# EAGLE schematic experimenter (EAGLE 9.6.2), part 1 of 2

## Sheet 1 of 2: NMOS Array
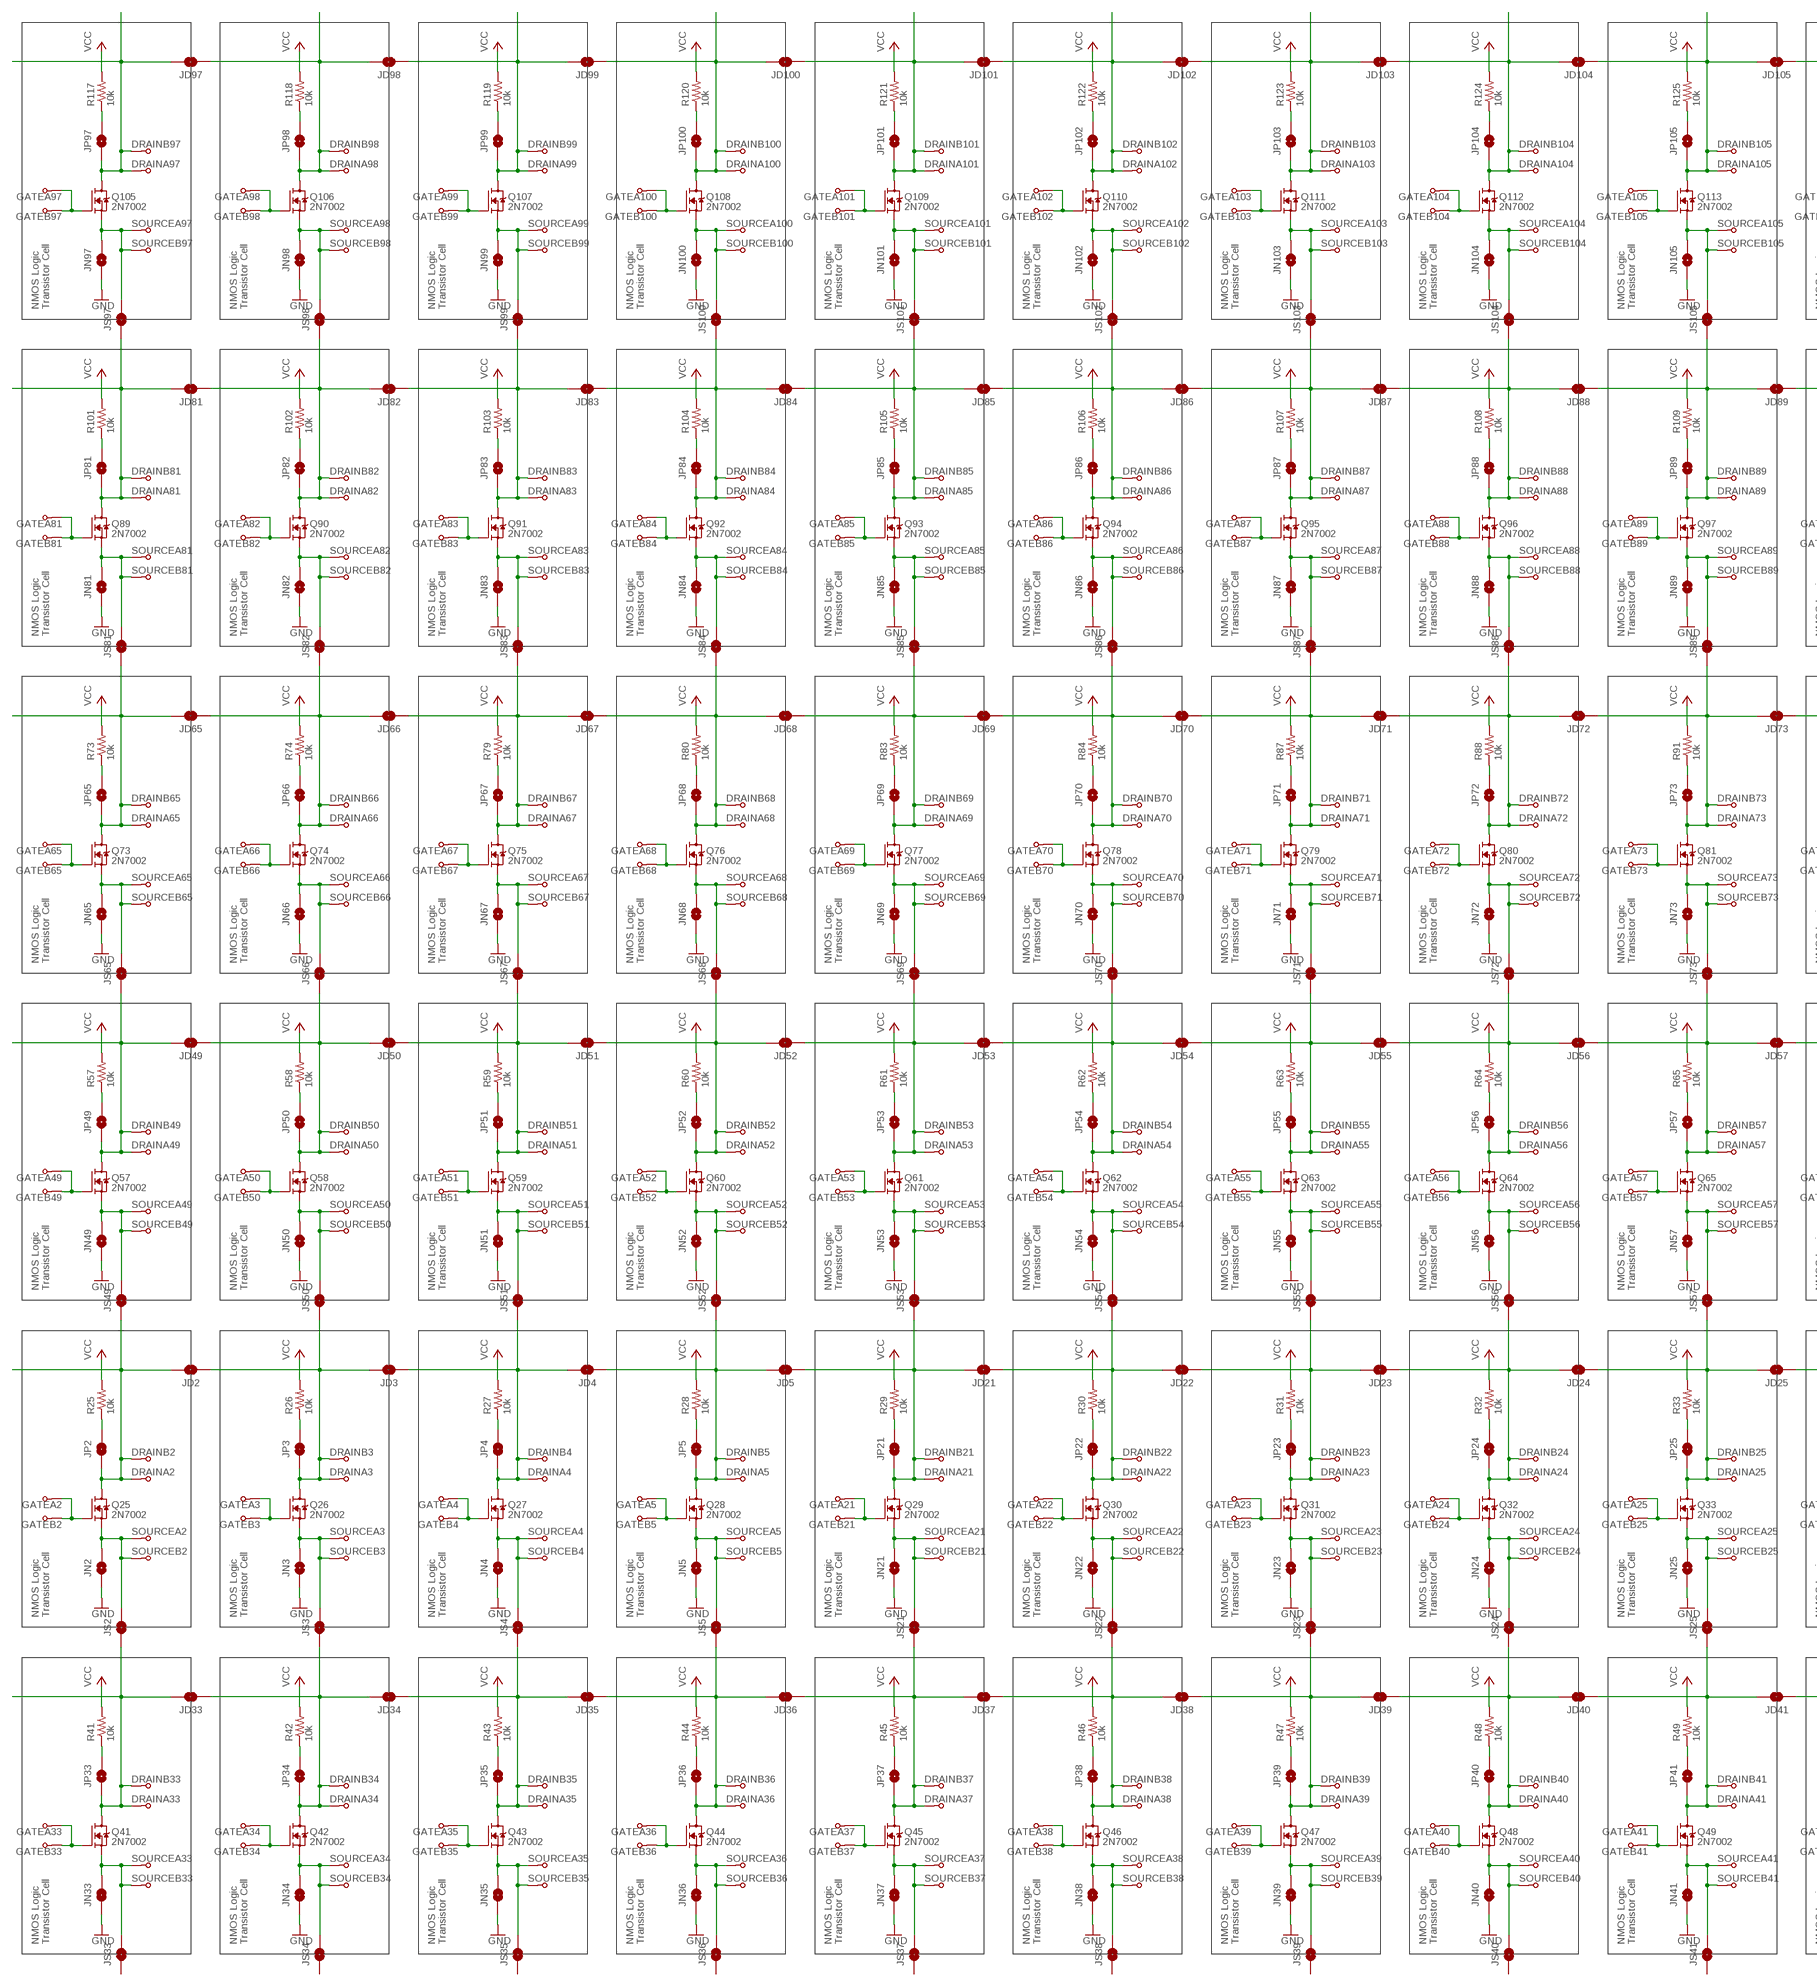
[diagram p0: schematic, sheet 1, part 1 of 2]
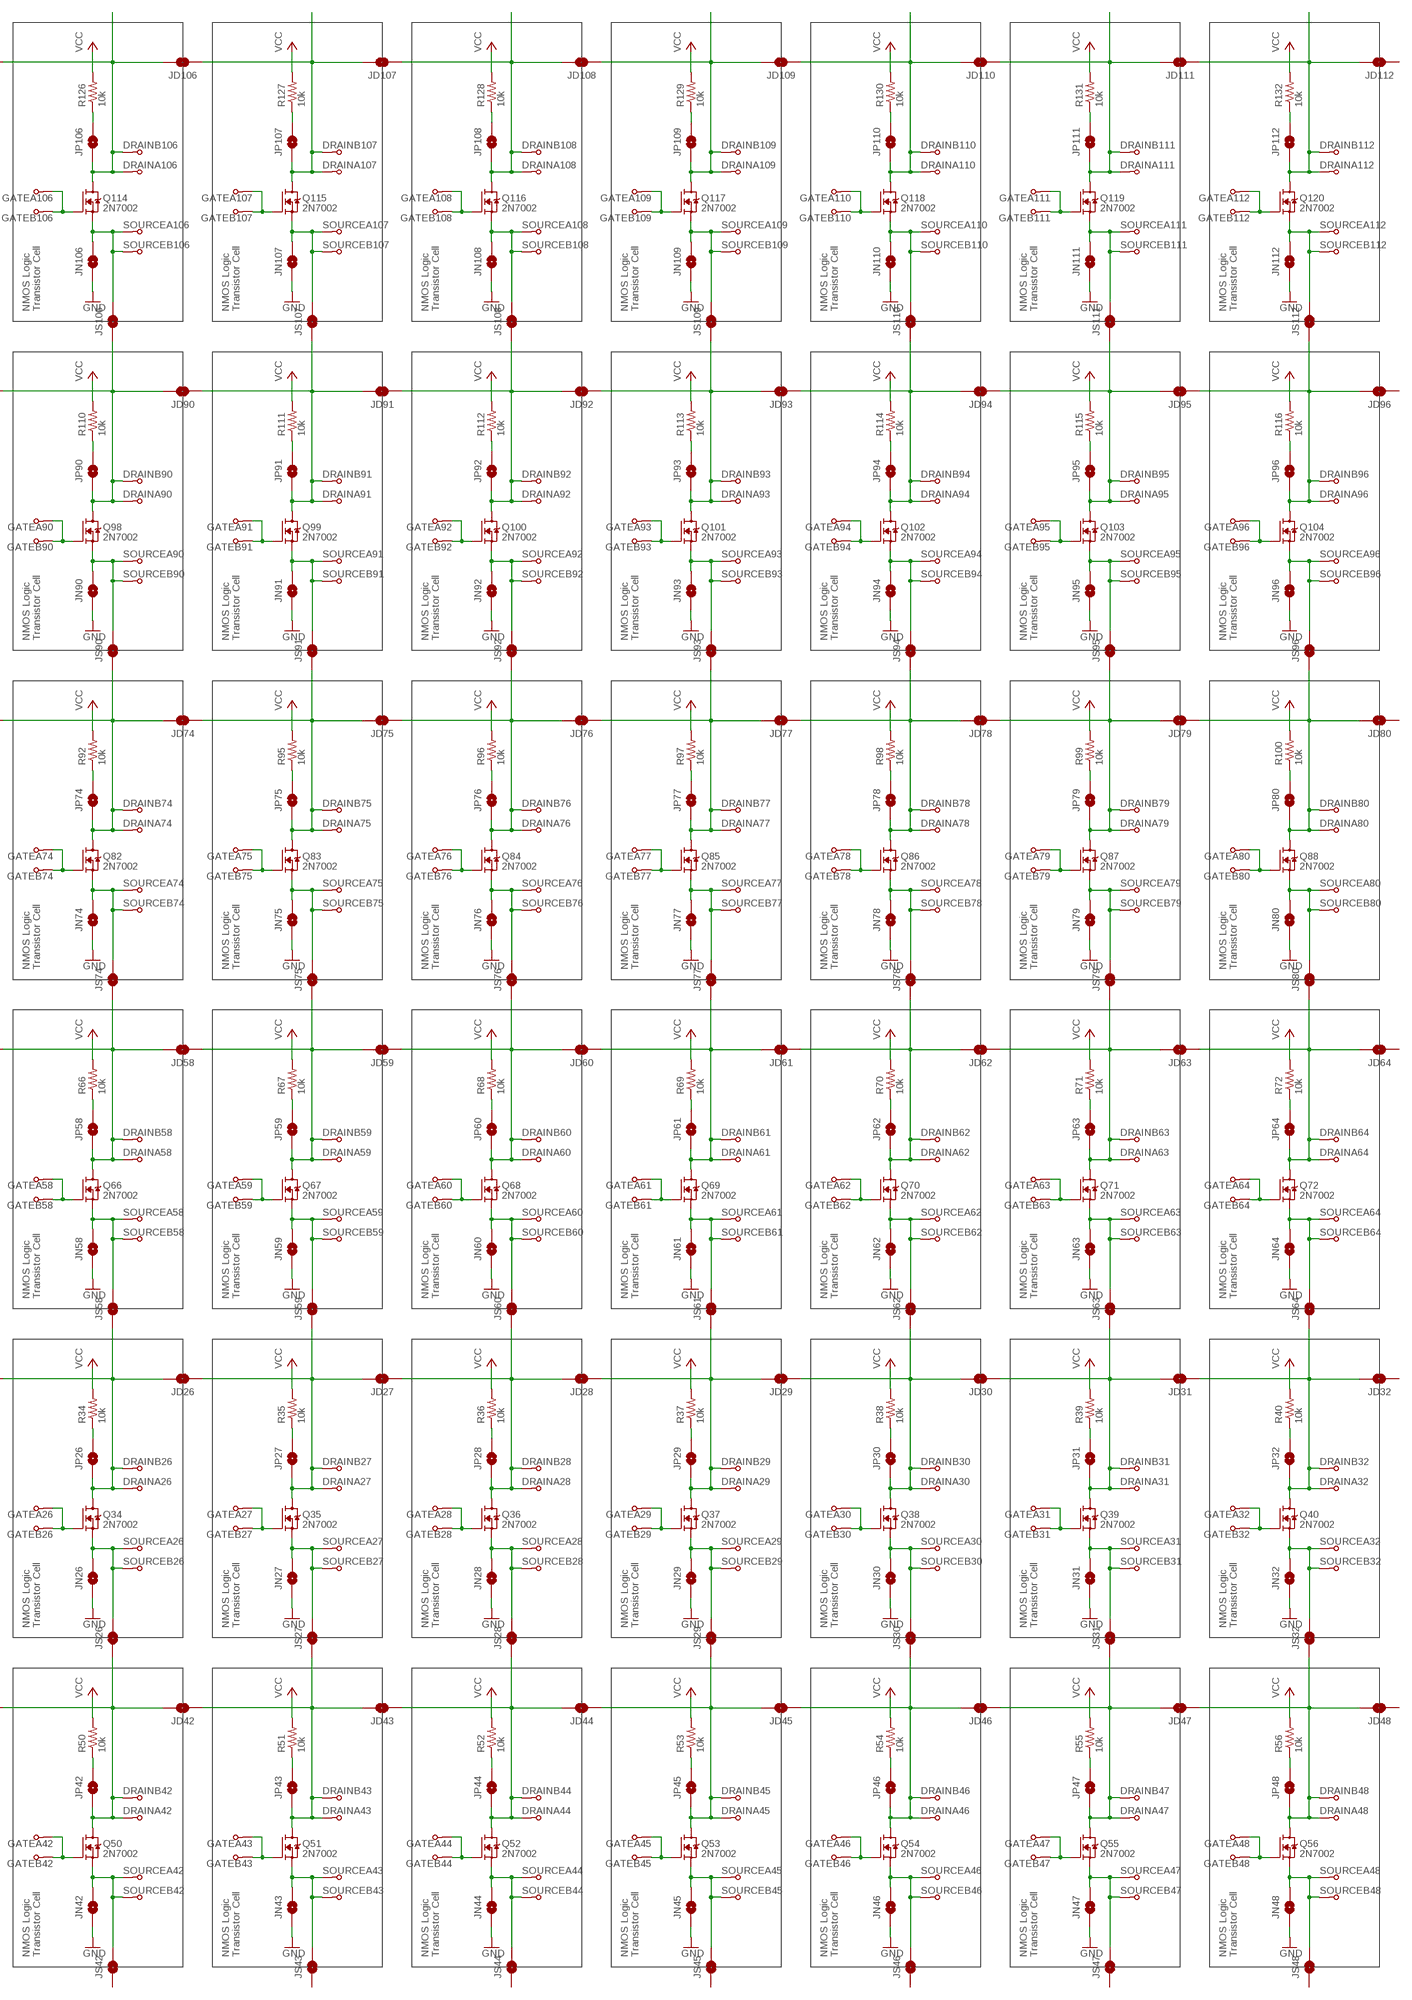
[diagram p1: schematic, sheet 1, part 2 of 2]

### Parts
DRAINA2  TPTHT  [PROTOPAD-THT-PAD]
DRAINA3  TPTHT  [PROTOPAD-THT-PAD]
DRAINA4  TPTHT  [PROTOPAD-THT-PAD]
DRAINA5  TPTHT  [PROTOPAD-THT-PAD]
DRAINA21  TPTHT  [PROTOPAD-THT-PAD]
DRAINA22  TPTHT  [PROTOPAD-THT-PAD]
DRAINA23  TPTHT  [PROTOPAD-THT-PAD]
DRAINA24  TPTHT  [PROTOPAD-THT-PAD]
DRAINA25  TPTHT  [PROTOPAD-THT-PAD]
DRAINA26  TPTHT  [PROTOPAD-THT-PAD]
DRAINA27  TPTHT  [PROTOPAD-THT-PAD]
DRAINA28  TPTHT  [PROTOPAD-THT-PAD]
DRAINA29  TPTHT  [PROTOPAD-THT-PAD]
DRAINA30  TPTHT  [PROTOPAD-THT-PAD]
DRAINA31  TPTHT  [PROTOPAD-THT-PAD]
DRAINA32  TPTHT  [PROTOPAD-THT-PAD]
DRAINA33  TPTHT  [PROTOPAD-THT-PAD]
DRAINA34  TPTHT  [PROTOPAD-THT-PAD]
DRAINA35  TPTHT  [PROTOPAD-THT-PAD]
DRAINA36  TPTHT  [PROTOPAD-THT-PAD]
DRAINA37  TPTHT  [PROTOPAD-THT-PAD]
DRAINA38  TPTHT  [PROTOPAD-THT-PAD]
DRAINA39  TPTHT  [PROTOPAD-THT-PAD]
DRAINA40  TPTHT  [PROTOPAD-THT-PAD]
DRAINA41  TPTHT  [PROTOPAD-THT-PAD]
DRAINA42  TPTHT  [PROTOPAD-THT-PAD]
DRAINA43  TPTHT  [PROTOPAD-THT-PAD]
DRAINA44  TPTHT  [PROTOPAD-THT-PAD]
DRAINA45  TPTHT  [PROTOPAD-THT-PAD]
DRAINA46  TPTHT  [PROTOPAD-THT-PAD]
DRAINA47  TPTHT  [PROTOPAD-THT-PAD]
DRAINA48  TPTHT  [PROTOPAD-THT-PAD]
DRAINA49  TPTHT  [PROTOPAD-THT-PAD]
DRAINA50  TPTHT  [PROTOPAD-THT-PAD]
DRAINA51  TPTHT  [PROTOPAD-THT-PAD]
DRAINA52  TPTHT  [PROTOPAD-THT-PAD]
DRAINA53  TPTHT  [PROTOPAD-THT-PAD]
DRAINA54  TPTHT  [PROTOPAD-THT-PAD]
DRAINA55  TPTHT  [PROTOPAD-THT-PAD]
DRAINA56  TPTHT  [PROTOPAD-THT-PAD]
DRAINA57  TPTHT  [PROTOPAD-THT-PAD]
DRAINA58  TPTHT  [PROTOPAD-THT-PAD]
DRAINA59  TPTHT  [PROTOPAD-THT-PAD]
DRAINA60  TPTHT  [PROTOPAD-THT-PAD]
DRAINA61  TPTHT  [PROTOPAD-THT-PAD]
DRAINA62  TPTHT  [PROTOPAD-THT-PAD]
DRAINA63  TPTHT  [PROTOPAD-THT-PAD]
DRAINA64  TPTHT  [PROTOPAD-THT-PAD]
DRAINA65  TPTHT  [PROTOPAD-THT-PAD]
DRAINA66  TPTHT  [PROTOPAD-THT-PAD]
DRAINA67  TPTHT  [PROTOPAD-THT-PAD]
DRAINA68  TPTHT  [PROTOPAD-THT-PAD]
DRAINA69  TPTHT  [PROTOPAD-THT-PAD]
DRAINA70  TPTHT  [PROTOPAD-THT-PAD]
DRAINA71  TPTHT  [PROTOPAD-THT-PAD]
DRAINA72  TPTHT  [PROTOPAD-THT-PAD]
DRAINA73  TPTHT  [PROTOPAD-THT-PAD]
DRAINA74  TPTHT  [PROTOPAD-THT-PAD]
DRAINA75  TPTHT  [PROTOPAD-THT-PAD]
DRAINA76  TPTHT  [PROTOPAD-THT-PAD]
DRAINA77  TPTHT  [PROTOPAD-THT-PAD]
DRAINA78  TPTHT  [PROTOPAD-THT-PAD]
DRAINA79  TPTHT  [PROTOPAD-THT-PAD]
DRAINA80  TPTHT  [PROTOPAD-THT-PAD]
DRAINA81  TPTHT  [PROTOPAD-THT-PAD]
DRAINA82  TPTHT  [PROTOPAD-THT-PAD]
DRAINA83  TPTHT  [PROTOPAD-THT-PAD]
DRAINA84  TPTHT  [PROTOPAD-THT-PAD]
DRAINA85  TPTHT  [PROTOPAD-THT-PAD]
DRAINA86  TPTHT  [PROTOPAD-THT-PAD]
DRAINA87  TPTHT  [PROTOPAD-THT-PAD]
DRAINA88  TPTHT  [PROTOPAD-THT-PAD]
DRAINA89  TPTHT  [PROTOPAD-THT-PAD]
DRAINA90  TPTHT  [PROTOPAD-THT-PAD]
DRAINA91  TPTHT  [PROTOPAD-THT-PAD]
DRAINA92  TPTHT  [PROTOPAD-THT-PAD]
DRAINA93  TPTHT  [PROTOPAD-THT-PAD]
DRAINA94  TPTHT  [PROTOPAD-THT-PAD]
DRAINA95  TPTHT  [PROTOPAD-THT-PAD]
DRAINA96  TPTHT  [PROTOPAD-THT-PAD]
DRAINA97  TPTHT  [PROTOPAD-THT-PAD]
DRAINA98  TPTHT  [PROTOPAD-THT-PAD]
DRAINA99  TPTHT  [PROTOPAD-THT-PAD]
DRAINA100  TPTHT  [PROTOPAD-THT-PAD]
DRAINA101  TPTHT  [PROTOPAD-THT-PAD]
DRAINA102  TPTHT  [PROTOPAD-THT-PAD]
DRAINA103  TPTHT  [PROTOPAD-THT-PAD]
DRAINA104  TPTHT  [PROTOPAD-THT-PAD]
DRAINA105  TPTHT  [PROTOPAD-THT-PAD]
DRAINA106  TPTHT  [PROTOPAD-THT-PAD]
DRAINA107  TPTHT  [PROTOPAD-THT-PAD]
DRAINA108  TPTHT  [PROTOPAD-THT-PAD]
DRAINA109  TPTHT  [PROTOPAD-THT-PAD]
DRAINA110  TPTHT  [PROTOPAD-THT-PAD]
DRAINA111  TPTHT  [PROTOPAD-THT-PAD]
DRAINA112  TPTHT  [PROTOPAD-THT-PAD]
DRAINB2  TPTHT  [PROTOPAD-THT-PAD]
DRAINB3  TPTHT  [PROTOPAD-THT-PAD]
DRAINB4  TPTHT  [PROTOPAD-THT-PAD]
DRAINB5  TPTHT  [PROTOPAD-THT-PAD]
DRAINB21  TPTHT  [PROTOPAD-THT-PAD]
DRAINB22  TPTHT  [PROTOPAD-THT-PAD]
DRAINB23  TPTHT  [PROTOPAD-THT-PAD]
DRAINB24  TPTHT  [PROTOPAD-THT-PAD]
DRAINB25  TPTHT  [PROTOPAD-THT-PAD]
DRAINB26  TPTHT  [PROTOPAD-THT-PAD]
DRAINB27  TPTHT  [PROTOPAD-THT-PAD]
DRAINB28  TPTHT  [PROTOPAD-THT-PAD]
DRAINB29  TPTHT  [PROTOPAD-THT-PAD]
DRAINB30  TPTHT  [PROTOPAD-THT-PAD]
DRAINB31  TPTHT  [PROTOPAD-THT-PAD]
DRAINB32  TPTHT  [PROTOPAD-THT-PAD]
DRAINB33  TPTHT  [PROTOPAD-THT-PAD]
DRAINB34  TPTHT  [PROTOPAD-THT-PAD]
DRAINB35  TPTHT  [PROTOPAD-THT-PAD]
DRAINB36  TPTHT  [PROTOPAD-THT-PAD]
DRAINB37  TPTHT  [PROTOPAD-THT-PAD]
DRAINB38  TPTHT  [PROTOPAD-THT-PAD]
DRAINB39  TPTHT  [PROTOPAD-THT-PAD]
DRAINB40  TPTHT  [PROTOPAD-THT-PAD]
DRAINB41  TPTHT  [PROTOPAD-THT-PAD]
DRAINB42  TPTHT  [PROTOPAD-THT-PAD]
DRAINB43  TPTHT  [PROTOPAD-THT-PAD]
DRAINB44  TPTHT  [PROTOPAD-THT-PAD]
DRAINB45  TPTHT  [PROTOPAD-THT-PAD]
DRAINB46  TPTHT  [PROTOPAD-THT-PAD]
DRAINB47  TPTHT  [PROTOPAD-THT-PAD]
DRAINB48  TPTHT  [PROTOPAD-THT-PAD]
DRAINB49  TPTHT  [PROTOPAD-THT-PAD]
DRAINB50  TPTHT  [PROTOPAD-THT-PAD]
DRAINB51  TPTHT  [PROTOPAD-THT-PAD]
DRAINB52  TPTHT  [PROTOPAD-THT-PAD]
DRAINB53  TPTHT  [PROTOPAD-THT-PAD]
DRAINB54  TPTHT  [PROTOPAD-THT-PAD]
DRAINB55  TPTHT  [PROTOPAD-THT-PAD]
DRAINB56  TPTHT  [PROTOPAD-THT-PAD]
DRAINB57  TPTHT  [PROTOPAD-THT-PAD]
DRAINB58  TPTHT  [PROTOPAD-THT-PAD]
DRAINB59  TPTHT  [PROTOPAD-THT-PAD]
DRAINB60  TPTHT  [PROTOPAD-THT-PAD]
DRAINB61  TPTHT  [PROTOPAD-THT-PAD]
DRAINB62  TPTHT  [PROTOPAD-THT-PAD]
DRAINB63  TPTHT  [PROTOPAD-THT-PAD]
DRAINB64  TPTHT  [PROTOPAD-THT-PAD]
DRAINB65  TPTHT  [PROTOPAD-THT-PAD]
DRAINB66  TPTHT  [PROTOPAD-THT-PAD]
DRAINB67  TPTHT  [PROTOPAD-THT-PAD]
DRAINB68  TPTHT  [PROTOPAD-THT-PAD]
DRAINB69  TPTHT  [PROTOPAD-THT-PAD]
DRAINB70  TPTHT  [PROTOPAD-THT-PAD]
DRAINB71  TPTHT  [PROTOPAD-THT-PAD]
DRAINB72  TPTHT  [PROTOPAD-THT-PAD]
DRAINB73  TPTHT  [PROTOPAD-THT-PAD]
DRAINB74  TPTHT  [PROTOPAD-THT-PAD]
DRAINB75  TPTHT  [PROTOPAD-THT-PAD]
DRAINB76  TPTHT  [PROTOPAD-THT-PAD]
DRAINB77  TPTHT  [PROTOPAD-THT-PAD]
DRAINB78  TPTHT  [PROTOPAD-THT-PAD]
DRAINB79  TPTHT  [PROTOPAD-THT-PAD]
DRAINB80  TPTHT  [PROTOPAD-THT-PAD]
DRAINB81  TPTHT  [PROTOPAD-THT-PAD]
DRAINB82  TPTHT  [PROTOPAD-THT-PAD]
DRAINB83  TPTHT  [PROTOPAD-THT-PAD]
DRAINB84  TPTHT  [PROTOPAD-THT-PAD]
DRAINB85  TPTHT  [PROTOPAD-THT-PAD]
DRAINB86  TPTHT  [PROTOPAD-THT-PAD]
DRAINB87  TPTHT  [PROTOPAD-THT-PAD]
DRAINB88  TPTHT  [PROTOPAD-THT-PAD]
DRAINB89  TPTHT  [PROTOPAD-THT-PAD]
DRAINB90  TPTHT  [PROTOPAD-THT-PAD]
DRAINB91  TPTHT  [PROTOPAD-THT-PAD]
DRAINB92  TPTHT  [PROTOPAD-THT-PAD]
DRAINB93  TPTHT  [PROTOPAD-THT-PAD]
DRAINB94  TPTHT  [PROTOPAD-THT-PAD]
DRAINB95  TPTHT  [PROTOPAD-THT-PAD]
DRAINB96  TPTHT  [PROTOPAD-THT-PAD]
DRAINB97  TPTHT  [PROTOPAD-THT-PAD]
DRAINB98  TPTHT  [PROTOPAD-THT-PAD]
DRAINB99  TPTHT  [PROTOPAD-THT-PAD]
DRAINB100  TPTHT  [PROTOPAD-THT-PAD]
DRAINB101  TPTHT  [PROTOPAD-THT-PAD]
DRAINB102  TPTHT  [PROTOPAD-THT-PAD]
DRAINB103  TPTHT  [PROTOPAD-THT-PAD]
DRAINB104  TPTHT  [PROTOPAD-THT-PAD]
DRAINB105  TPTHT  [PROTOPAD-THT-PAD]
DRAINB106  TPTHT  [PROTOPAD-THT-PAD]
DRAINB107  TPTHT  [PROTOPAD-THT-PAD]
DRAINB108  TPTHT  [PROTOPAD-THT-PAD]
DRAINB109  TPTHT  [PROTOPAD-THT-PAD]
DRAINB110  TPTHT  [PROTOPAD-THT-PAD]
DRAINB111  TPTHT  [PROTOPAD-THT-PAD]
DRAINB112  TPTHT  [PROTOPAD-THT-PAD]
GATEA2  TPTHT  [PROTOPAD-THT-PAD]
GATEA3  TPTHT  [PROTOPAD-THT-PAD]
GATEA4  TPTHT  [PROTOPAD-THT-PAD]
GATEA5  TPTHT  [PROTOPAD-THT-PAD]
GATEA21  TPTHT  [PROTOPAD-THT-PAD]
GATEA22  TPTHT  [PROTOPAD-THT-PAD]
GATEA23  TPTHT  [PROTOPAD-THT-PAD]
GATEA24  TPTHT  [PROTOPAD-THT-PAD]
GATEA25  TPTHT  [PROTOPAD-THT-PAD]
GATEA26  TPTHT  [PROTOPAD-THT-PAD]
GATEA27  TPTHT  [PROTOPAD-THT-PAD]
GATEA28  TPTHT  [PROTOPAD-THT-PAD]
GATEA29  TPTHT  [PROTOPAD-THT-PAD]
GATEA30  TPTHT  [PROTOPAD-THT-PAD]
GATEA31  TPTHT  [PROTOPAD-THT-PAD]
GATEA32  TPTHT  [PROTOPAD-THT-PAD]
GATEA33  TPTHT  [PROTOPAD-THT-PAD]
GATEA34  TPTHT  [PROTOPAD-THT-PAD]
GATEA35  TPTHT  [PROTOPAD-THT-PAD]
GATEA36  TPTHT  [PROTOPAD-THT-PAD]
GATEA37  TPTHT  [PROTOPAD-THT-PAD]
GATEA38  TPTHT  [PROTOPAD-THT-PAD]
GATEA39  TPTHT  [PROTOPAD-THT-PAD]
GATEA40  TPTHT  [PROTOPAD-THT-PAD]
GATEA41  TPTHT  [PROTOPAD-THT-PAD]
GATEA42  TPTHT  [PROTOPAD-THT-PAD]
GATEA43  TPTHT  [PROTOPAD-THT-PAD]
GATEA44  TPTHT  [PROTOPAD-THT-PAD]
GATEA45  TPTHT  [PROTOPAD-THT-PAD]
GATEA46  TPTHT  [PROTOPAD-THT-PAD]
GATEA47  TPTHT  [PROTOPAD-THT-PAD]
GATEA48  TPTHT  [PROTOPAD-THT-PAD]
GATEA49  TPTHT  [PROTOPAD-THT-PAD]
GATEA50  TPTHT  [PROTOPAD-THT-PAD]
GATEA51  TPTHT  [PROTOPAD-THT-PAD]
GATEA52  TPTHT  [PROTOPAD-THT-PAD]
GATEA53  TPTHT  [PROTOPAD-THT-PAD]
GATEA54  TPTHT  [PROTOPAD-THT-PAD]
GATEA55  TPTHT  [PROTOPAD-THT-PAD]
GATEA56  TPTHT  [PROTOPAD-THT-PAD]
GATEA57  TPTHT  [PROTOPAD-THT-PAD]
GATEA58  TPTHT  [PROTOPAD-THT-PAD]
GATEA59  TPTHT  [PROTOPAD-THT-PAD]
GATEA60  TPTHT  [PROTOPAD-THT-PAD]
GATEA61  TPTHT  [PROTOPAD-THT-PAD]
GATEA62  TPTHT  [PROTOPAD-THT-PAD]
GATEA63  TPTHT  [PROTOPAD-THT-PAD]
GATEA64  TPTHT  [PROTOPAD-THT-PAD]
GATEA65  TPTHT  [PROTOPAD-THT-PAD]
GATEA66  TPTHT  [PROTOPAD-THT-PAD]
GATEA67  TPTHT  [PROTOPAD-THT-PAD]
GATEA68  TPTHT  [PROTOPAD-THT-PAD]
GATEA69  TPTHT  [PROTOPAD-THT-PAD]
GATEA70  TPTHT  [PROTOPAD-THT-PAD]
GATEA71  TPTHT  [PROTOPAD-THT-PAD]
GATEA72  TPTHT  [PROTOPAD-THT-PAD]
GATEA73  TPTHT  [PROTOPAD-THT-PAD]
GATEA74  TPTHT  [PROTOPAD-THT-PAD]
GATEA75  TPTHT  [PROTOPAD-THT-PAD]
GATEA76  TPTHT  [PROTOPAD-THT-PAD]
GATEA77  TPTHT  [PROTOPAD-THT-PAD]
GATEA78  TPTHT  [PROTOPAD-THT-PAD]
GATEA79  TPTHT  [PROTOPAD-THT-PAD]
GATEA80  TPTHT  [PROTOPAD-THT-PAD]
GATEA81  TPTHT  [PROTOPAD-THT-PAD]
GATEA82  TPTHT  [PROTOPAD-THT-PAD]
GATEA83  TPTHT  [PROTOPAD-THT-PAD]
GATEA84  TPTHT  [PROTOPAD-THT-PAD]
GATEA85  TPTHT  [PROTOPAD-THT-PAD]
GATEA86  TPTHT  [PROTOPAD-THT-PAD]
GATEA87  TPTHT  [PROTOPAD-THT-PAD]
GATEA88  TPTHT  [PROTOPAD-THT-PAD]
GATEA89  TPTHT  [PROTOPAD-THT-PAD]
GATEA90  TPTHT  [PROTOPAD-THT-PAD]
GATEA91  TPTHT  [PROTOPAD-THT-PAD]
GATEA92  TPTHT  [PROTOPAD-THT-PAD]
GATEA93  TPTHT  [PROTOPAD-THT-PAD]
GATEA94  TPTHT  [PROTOPAD-THT-PAD]
GATEA95  TPTHT  [PROTOPAD-THT-PAD]
GATEA96  TPTHT  [PROTOPAD-THT-PAD]
GATEA97  TPTHT  [PROTOPAD-THT-PAD]
GATEA98  TPTHT  [PROTOPAD-THT-PAD]
GATEA99  TPTHT  [PROTOPAD-THT-PAD]
GATEA100  TPTHT  [PROTOPAD-THT-PAD]
GATEA101  TPTHT  [PROTOPAD-THT-PAD]
GATEA102  TPTHT  [PROTOPAD-THT-PAD]
GATEA103  TPTHT  [PROTOPAD-THT-PAD]
GATEA104  TPTHT  [PROTOPAD-THT-PAD]
GATEA105  TPTHT  [PROTOPAD-THT-PAD]
GATEA106  TPTHT  [PROTOPAD-THT-PAD]
GATEA107  TPTHT  [PROTOPAD-THT-PAD]
GATEA108  TPTHT  [PROTOPAD-THT-PAD]
GATEA109  TPTHT  [PROTOPAD-THT-PAD]
GATEA110  TPTHT  [PROTOPAD-THT-PAD]
GATEA111  TPTHT  [PROTOPAD-THT-PAD]
GATEA112  TPTHT  [PROTOPAD-THT-PAD]
GATEB2  TPTHT  [PROTOPAD-THT-PAD]
GATEB3  TPTHT  [PROTOPAD-THT-PAD]
GATEB4  TPTHT  [PROTOPAD-THT-PAD]
GATEB5  TPTHT  [PROTOPAD-THT-PAD]
GATEB21  TPTHT  [PROTOPAD-THT-PAD]
GATEB22  TPTHT  [PROTOPAD-THT-PAD]
GATEB23  TPTHT  [PROTOPAD-THT-PAD]
GATEB24  TPTHT  [PROTOPAD-THT-PAD]
GATEB25  TPTHT  [PROTOPAD-THT-PAD]
GATEB26  TPTHT  [PROTOPAD-THT-PAD]
GATEB27  TPTHT  [PROTOPAD-THT-PAD]
GATEB28  TPTHT  [PROTOPAD-THT-PAD]
GATEB29  TPTHT  [PROTOPAD-THT-PAD]
GATEB30  TPTHT  [PROTOPAD-THT-PAD]
GATEB31  TPTHT  [PROTOPAD-THT-PAD]
GATEB32  TPTHT  [PROTOPAD-THT-PAD]
GATEB33  TPTHT  [PROTOPAD-THT-PAD]
GATEB34  TPTHT  [PROTOPAD-THT-PAD]
GATEB35  TPTHT  [PROTOPAD-THT-PAD]
GATEB36  TPTHT  [PROTOPAD-THT-PAD]
GATEB37  TPTHT  [PROTOPAD-THT-PAD]
GATEB38  TPTHT  [PROTOPAD-THT-PAD]
GATEB39  TPTHT  [PROTOPAD-THT-PAD]
GATEB40  TPTHT  [PROTOPAD-THT-PAD]
GATEB41  TPTHT  [PROTOPAD-THT-PAD]
GATEB42  TPTHT  [PROTOPAD-THT-PAD]
GATEB43  TPTHT  [PROTOPAD-THT-PAD]
GATEB44  TPTHT  [PROTOPAD-THT-PAD]
GATEB45  TPTHT  [PROTOPAD-THT-PAD]
GATEB46  TPTHT  [PROTOPAD-THT-PAD]
GATEB47  TPTHT  [PROTOPAD-THT-PAD]
GATEB48  TPTHT  [PROTOPAD-THT-PAD]
GATEB49  TPTHT  [PROTOPAD-THT-PAD]
GATEB50  TPTHT  [PROTOPAD-THT-PAD]
GATEB51  TPTHT  [PROTOPAD-THT-PAD]
GATEB52  TPTHT  [PROTOPAD-THT-PAD]
GATEB53  TPTHT  [PROTOPAD-THT-PAD]
GATEB54  TPTHT  [PROTOPAD-THT-PAD]
GATEB55  TPTHT  [PROTOPAD-THT-PAD]
GATEB56  TPTHT  [PROTOPAD-THT-PAD]
GATEB57  TPTHT  [PROTOPAD-THT-PAD]
GATEB58  TPTHT  [PROTOPAD-THT-PAD]
GATEB59  TPTHT  [PROTOPAD-THT-PAD]
GATEB60  TPTHT  [PROTOPAD-THT-PAD]
GATEB61  TPTHT  [PROTOPAD-THT-PAD]
GATEB62  TPTHT  [PROTOPAD-THT-PAD]
GATEB63  TPTHT  [PROTOPAD-THT-PAD]
GATEB64  TPTHT  [PROTOPAD-THT-PAD]
GATEB65  TPTHT  [PROTOPAD-THT-PAD]
GATEB66  TPTHT  [PROTOPAD-THT-PAD]
GATEB67  TPTHT  [PROTOPAD-THT-PAD]
GATEB68  TPTHT  [PROTOPAD-THT-PAD]
GATEB69  TPTHT  [PROTOPAD-THT-PAD]
GATEB70  TPTHT  [PROTOPAD-THT-PAD]
GATEB71  TPTHT  [PROTOPAD-THT-PAD]
GATEB72  TPTHT  [PROTOPAD-THT-PAD]
GATEB73  TPTHT  [PROTOPAD-THT-PAD]
GATEB74  TPTHT  [PROTOPAD-THT-PAD]
GATEB75  TPTHT  [PROTOPAD-THT-PAD]
GATEB76  TPTHT  [PROTOPAD-THT-PAD]
GATEB77  TPTHT  [PROTOPAD-THT-PAD]
GATEB78  TPTHT  [PROTOPAD-THT-PAD]
GATEB79  TPTHT  [PROTOPAD-THT-PAD]
GATEB80  TPTHT  [PROTOPAD-THT-PAD]
GATEB81  TPTHT  [PROTOPAD-THT-PAD]
GATEB82  TPTHT  [PROTOPAD-THT-PAD]
GATEB83  TPTHT  [PROTOPAD-THT-PAD]
GATEB84  TPTHT  [PROTOPAD-THT-PAD]
GATEB85  TPTHT  [PROTOPAD-THT-PAD]
GATEB86  TPTHT  [PROTOPAD-THT-PAD]
GATEB87  TPTHT  [PROTOPAD-THT-PAD]
GATEB88  TPTHT  [PROTOPAD-THT-PAD]
GATEB89  TPTHT  [PROTOPAD-THT-PAD]
GATEB90  TPTHT  [PROTOPAD-THT-PAD]
GATEB91  TPTHT  [PROTOPAD-THT-PAD]
GATEB92  TPTHT  [PROTOPAD-THT-PAD]
GATEB93  TPTHT  [PROTOPAD-THT-PAD]
GATEB94  TPTHT  [PROTOPAD-THT-PAD]
GATEB95  TPTHT  [PROTOPAD-THT-PAD]
GATEB96  TPTHT  [PROTOPAD-THT-PAD]
GATEB97  TPTHT  [PROTOPAD-THT-PAD]
GATEB98  TPTHT  [PROTOPAD-THT-PAD]
GATEB99  TPTHT  [PROTOPAD-THT-PAD]
GATEB100  TPTHT  [PROTOPAD-THT-PAD]
GATEB101  TPTHT  [PROTOPAD-THT-PAD]
GATEB102  TPTHT  [PROTOPAD-THT-PAD]
GATEB103  TPTHT  [PROTOPAD-THT-PAD]
GATEB104  TPTHT  [PROTOPAD-THT-PAD]
GATEB105  TPTHT  [PROTOPAD-THT-PAD]
GATEB106  TPTHT  [PROTOPAD-THT-PAD]
GATEB107  TPTHT  [PROTOPAD-THT-PAD]
GATEB108  TPTHT  [PROTOPAD-THT-PAD]
GATEB109  TPTHT  [PROTOPAD-THT-PAD]
GATEB110  TPTHT  [PROTOPAD-THT-PAD]
GATEB111  TPTHT  [PROTOPAD-THT-PAD]
GATEB112  TPTHT  [PROTOPAD-THT-PAD]
JD2  SJ_NO_THIN  [SJ_2S-NO-THIN]
JD3  SJ_NO_THIN  [SJ_2S-NO-THIN]
JD4  SJ_NO_THIN  [SJ_2S-NO-THIN]
JD5  SJ_NO_THIN  [SJ_2S-NO-THIN]
JD21  SJ_NO_THIN  [SJ_2S-NO-THIN]
JD22  SJ_NO_THIN  [SJ_2S-NO-THIN]
JD23  SJ_NO_THIN  [SJ_2S-NO-THIN]
JD24  SJ_NO_THIN  [SJ_2S-NO-THIN]
JD25  SJ_NO_THIN  [SJ_2S-NO-THIN]
JD26  SJ_NO_THIN  [SJ_2S-NO-THIN]
JD27  SJ_NO_THIN  [SJ_2S-NO-THIN]
JD28  SJ_NO_THIN  [SJ_2S-NO-THIN]
JD29  SJ_NO_THIN  [SJ_2S-NO-THIN]
JD30  SJ_NO_THIN  [SJ_2S-NO-THIN]
JD31  SJ_NO_THIN  [SJ_2S-NO-THIN]
JD32  SJ_NO_THIN  [SJ_2S-NO-THIN]
JD33  SJ_NO_THIN  [SJ_2S-NO-THIN]
JD34  SJ_NO_THIN  [SJ_2S-NO-THIN]
JD35  SJ_NO_THIN  [SJ_2S-NO-THIN]
JD36  SJ_NO_THIN  [SJ_2S-NO-THIN]
JD37  SJ_NO_THIN  [SJ_2S-NO-THIN]
JD38  SJ_NO_THIN  [SJ_2S-NO-THIN]
JD39  SJ_NO_THIN  [SJ_2S-NO-THIN]
JD40  SJ_NO_THIN  [SJ_2S-NO-THIN]
JD41  SJ_NO_THIN  [SJ_2S-NO-THIN]
JD42  SJ_NO_THIN  [SJ_2S-NO-THIN]
JD43  SJ_NO_THIN  [SJ_2S-NO-THIN]
JD44  SJ_NO_THIN  [SJ_2S-NO-THIN]
JD45  SJ_NO_THIN  [SJ_2S-NO-THIN]
JD46  SJ_NO_THIN  [SJ_2S-NO-THIN]
JD47  SJ_NO_THIN  [SJ_2S-NO-THIN]
JD48  SJ_NO_THIN  [SJ_2S-NO-THIN]
JD49  SJ_NO_THIN  [SJ_2S-NO-THIN]
JD50  SJ_NO_THIN  [SJ_2S-NO-THIN]
JD51  SJ_NO_THIN  [SJ_2S-NO-THIN]
JD52  SJ_NO_THIN  [SJ_2S-NO-THIN]
JD53  SJ_NO_THIN  [SJ_2S-NO-THIN]
JD54  SJ_NO_THIN  [SJ_2S-NO-THIN]
JD55  SJ_NO_THIN  [SJ_2S-NO-THIN]
JD56  SJ_NO_THIN  [SJ_2S-NO-THIN]
JD57  SJ_NO_THIN  [SJ_2S-NO-THIN]
JD58  SJ_NO_THIN  [SJ_2S-NO-THIN]
JD59  SJ_NO_THIN  [SJ_2S-NO-THIN]
JD60  SJ_NO_THIN  [SJ_2S-NO-THIN]
JD61  SJ_NO_THIN  [SJ_2S-NO-THIN]
JD62  SJ_NO_THIN  [SJ_2S-NO-THIN]
JD63  SJ_NO_THIN  [SJ_2S-NO-THIN]
JD64  SJ_NO_THIN  [SJ_2S-NO-THIN]
JD65  SJ_NO_THIN  [SJ_2S-NO-THIN]
JD66  SJ_NO_THIN  [SJ_2S-NO-THIN]
JD67  SJ_NO_THIN  [SJ_2S-NO-THIN]
JD68  SJ_NO_THIN  [SJ_2S-NO-THIN]
JD69  SJ_NO_THIN  [SJ_2S-NO-THIN]
JD70  SJ_NO_THIN  [SJ_2S-NO-THIN]
JD71  SJ_NO_THIN  [SJ_2S-NO-THIN]
JD72  SJ_NO_THIN  [SJ_2S-NO-THIN]
JD73  SJ_NO_THIN  [SJ_2S-NO-THIN]
JD74  SJ_NO_THIN  [SJ_2S-NO-THIN]
JD75  SJ_NO_THIN  [SJ_2S-NO-THIN]
JD76  SJ_NO_THIN  [SJ_2S-NO-THIN]
JD77  SJ_NO_THIN  [SJ_2S-NO-THIN]
JD78  SJ_NO_THIN  [SJ_2S-NO-THIN]
JD79  SJ_NO_THIN  [SJ_2S-NO-THIN]
JD80  SJ_NO_THIN  [SJ_2S-NO-THIN]
JD81  SJ_NO_THIN  [SJ_2S-NO-THIN]
JD82  SJ_NO_THIN  [SJ_2S-NO-THIN]
JD83  SJ_NO_THIN  [SJ_2S-NO-THIN]
JD84  SJ_NO_THIN  [SJ_2S-NO-THIN]
JD85  SJ_NO_THIN  [SJ_2S-NO-THIN]
JD86  SJ_NO_THIN  [SJ_2S-NO-THIN]
JD87  SJ_NO_THIN  [SJ_2S-NO-THIN]
JD88  SJ_NO_THIN  [SJ_2S-NO-THIN]
JD89  SJ_NO_THIN  [SJ_2S-NO-THIN]
JD90  SJ_NO_THIN  [SJ_2S-NO-THIN]
JD91  SJ_NO_THIN  [SJ_2S-NO-THIN]
JD92  SJ_NO_THIN  [SJ_2S-NO-THIN]
JD93  SJ_NO_THIN  [SJ_2S-NO-THIN]
JD94  SJ_NO_THIN  [SJ_2S-NO-THIN]
JD95  SJ_NO_THIN  [SJ_2S-NO-THIN]
JD96  SJ_NO_THIN  [SJ_2S-NO-THIN]
JD97  SJ_NO_THIN  [SJ_2S-NO-THIN]
JD98  SJ_NO_THIN  [SJ_2S-NO-THIN]
JD99  SJ_NO_THIN  [SJ_2S-NO-THIN]
JD100  SJ_NO_THIN  [SJ_2S-NO-THIN]
JD101  SJ_NO_THIN  [SJ_2S-NO-THIN]
JD102  SJ_NO_THIN  [SJ_2S-NO-THIN]
JD103  SJ_NO_THIN  [SJ_2S-NO-THIN]
JD104  SJ_NO_THIN  [SJ_2S-NO-THIN]
JD105  SJ_NO_THIN  [SJ_2S-NO-THIN]
JD106  SJ_NO_THIN  [SJ_2S-NO-THIN]
JD107  SJ_NO_THIN  [SJ_2S-NO-THIN]
JD108  SJ_NO_THIN  [SJ_2S-NO-THIN]
JD109  SJ_NO_THIN  [SJ_2S-NO-THIN]
JD110  SJ_NO_THIN  [SJ_2S-NO-THIN]
JD111  SJ_NO_THIN  [SJ_2S-NO-THIN]
JD112  SJ_NO_THIN  [SJ_2S-NO-THIN]
JN2  SJ_NO_THIN  [SJ_2S-NO-THIN]
JN3  SJ_NO_THIN  [SJ_2S-NO-THIN]
JN4  SJ_NO_THIN  [SJ_2S-NO-THIN]
JN5  SJ_NO_THIN  [SJ_2S-NO-THIN]
JN21  SJ_NO_THIN  [SJ_2S-NO-THIN]
JN22  SJ_NO_THIN  [SJ_2S-NO-THIN]
JN23  SJ_NO_THIN  [SJ_2S-NO-THIN]
JN24  SJ_NO_THIN  [SJ_2S-NO-THIN]
JN25  SJ_NO_THIN  [SJ_2S-NO-THIN]
JN26  SJ_NO_THIN  [SJ_2S-NO-THIN]
JN27  SJ_NO_THIN  [SJ_2S-NO-THIN]
JN28  SJ_NO_THIN  [SJ_2S-NO-THIN]
JN29  SJ_NO_THIN  [SJ_2S-NO-THIN]
JN30  SJ_NO_THIN  [SJ_2S-NO-THIN]
JN31  SJ_NO_THIN  [SJ_2S-NO-THIN]
JN32  SJ_NO_THIN  [SJ_2S-NO-THIN]
JN33  SJ_NO_THIN  [SJ_2S-NO-THIN]
JN34  SJ_NO_THIN  [SJ_2S-NO-THIN]
JN35  SJ_NO_THIN  [SJ_2S-NO-THIN]
JN36  SJ_NO_THIN  [SJ_2S-NO-THIN]
JN37  SJ_NO_THIN  [SJ_2S-NO-THIN]
JN38  SJ_NO_THIN  [SJ_2S-NO-THIN]
JN39  SJ_NO_THIN  [SJ_2S-NO-THIN]
JN40  SJ_NO_THIN  [SJ_2S-NO-THIN]
JN41  SJ_NO_THIN  [SJ_2S-NO-THIN]
JN42  SJ_NO_THIN  [SJ_2S-NO-THIN]
JN43  SJ_NO_THIN  [SJ_2S-NO-THIN]
JN44  SJ_NO_THIN  [SJ_2S-NO-THIN]
JN45  SJ_NO_THIN  [SJ_2S-NO-THIN]
JN46  SJ_NO_THIN  [SJ_2S-NO-THIN]
JN47  SJ_NO_THIN  [SJ_2S-NO-THIN]
JN48  SJ_NO_THIN  [SJ_2S-NO-THIN]
JN49  SJ_NO_THIN  [SJ_2S-NO-THIN]
JN50  SJ_NO_THIN  [SJ_2S-NO-THIN]
JN51  SJ_NO_THIN  [SJ_2S-NO-THIN]
JN52  SJ_NO_THIN  [SJ_2S-NO-THIN]
JN53  SJ_NO_THIN  [SJ_2S-NO-THIN]
JN54  SJ_NO_THIN  [SJ_2S-NO-THIN]
JN55  SJ_NO_THIN  [SJ_2S-NO-THIN]
JN56  SJ_NO_THIN  [SJ_2S-NO-THIN]
JN57  SJ_NO_THIN  [SJ_2S-NO-THIN]
JN58  SJ_NO_THIN  [SJ_2S-NO-THIN]
JN59  SJ_NO_THIN  [SJ_2S-NO-THIN]
JN60  SJ_NO_THIN  [SJ_2S-NO-THIN]
JN61  SJ_NO_THIN  [SJ_2S-NO-THIN]
JN62  SJ_NO_THIN  [SJ_2S-NO-THIN]
JN63  SJ_NO_THIN  [SJ_2S-NO-THIN]
JN64  SJ_NO_THIN  [SJ_2S-NO-THIN]
JN65  SJ_NO_THIN  [SJ_2S-NO-THIN]
JN66  SJ_NO_THIN  [SJ_2S-NO-THIN]
JN67  SJ_NO_THIN  [SJ_2S-NO-THIN]
JN68  SJ_NO_THIN  [SJ_2S-NO-THIN]
JN69  SJ_NO_THIN  [SJ_2S-NO-THIN]
JN70  SJ_NO_THIN  [SJ_2S-NO-THIN]
JN71  SJ_NO_THIN  [SJ_2S-NO-THIN]
JN72  SJ_NO_THIN  [SJ_2S-NO-THIN]
JN73  SJ_NO_THIN  [SJ_2S-NO-THIN]
JN74  SJ_NO_THIN  [SJ_2S-NO-THIN]
JN75  SJ_NO_THIN  [SJ_2S-NO-THIN]
JN76  SJ_NO_THIN  [SJ_2S-NO-THIN]
JN77  SJ_NO_THIN  [SJ_2S-NO-THIN]
JN78  SJ_NO_THIN  [SJ_2S-NO-THIN]
JN79  SJ_NO_THIN  [SJ_2S-NO-THIN]
JN80  SJ_NO_THIN  [SJ_2S-NO-THIN]
JN81  SJ_NO_THIN  [SJ_2S-NO-THIN]
JN82  SJ_NO_THIN  [SJ_2S-NO-THIN]
JN83  SJ_NO_THIN  [SJ_2S-NO-THIN]
JN84  SJ_NO_THIN  [SJ_2S-NO-THIN]
JN85  SJ_NO_THIN  [SJ_2S-NO-THIN]
JN86  SJ_NO_THIN  [SJ_2S-NO-THIN]
JN87  SJ_NO_THIN  [SJ_2S-NO-THIN]
JN88  SJ_NO_THIN  [SJ_2S-NO-THIN]
JN89  SJ_NO_THIN  [SJ_2S-NO-THIN]
JN90  SJ_NO_THIN  [SJ_2S-NO-THIN]
JN91  SJ_NO_THIN  [SJ_2S-NO-THIN]
JN92  SJ_NO_THIN  [SJ_2S-NO-THIN]
JN93  SJ_NO_THIN  [SJ_2S-NO-THIN]
JN94  SJ_NO_THIN  [SJ_2S-NO-THIN]
JN95  SJ_NO_THIN  [SJ_2S-NO-THIN]
JN96  SJ_NO_THIN  [SJ_2S-NO-THIN]
JN97  SJ_NO_THIN  [SJ_2S-NO-THIN]
JN98  SJ_NO_THIN  [SJ_2S-NO-THIN]
JN99  SJ_NO_THIN  [SJ_2S-NO-THIN]
JN100  SJ_NO_THIN  [SJ_2S-NO-THIN]
JN101  SJ_NO_THIN  [SJ_2S-NO-THIN]
JN102  SJ_NO_THIN  [SJ_2S-NO-THIN]
JN103  SJ_NO_THIN  [SJ_2S-NO-THIN]
JN104  SJ_NO_THIN  [SJ_2S-NO-THIN]
JN105  SJ_NO_THIN  [SJ_2S-NO-THIN]
JN106  SJ_NO_THIN  [SJ_2S-NO-THIN]
JN107  SJ_NO_THIN  [SJ_2S-NO-THIN]
JN108  SJ_NO_THIN  [SJ_2S-NO-THIN]
JN109  SJ_NO_THIN  [SJ_2S-NO-THIN]
JN110  SJ_NO_THIN  [SJ_2S-NO-THIN]
JN111  SJ_NO_THIN  [SJ_2S-NO-THIN]
JN112  SJ_NO_THIN  [SJ_2S-NO-THIN]
JP2  SJ_NO_THIN  [SJ_2S-NO-THIN]
JP3  SJ_NO_THIN  [SJ_2S-NO-THIN]
JP4  SJ_NO_THIN  [SJ_2S-NO-THIN]
JP5  SJ_NO_THIN  [SJ_2S-NO-THIN]
JP21  SJ_NO_THIN  [SJ_2S-NO-THIN]
JP22  SJ_NO_THIN  [SJ_2S-NO-THIN]
JP23  SJ_NO_THIN  [SJ_2S-NO-THIN]
JP24  SJ_NO_THIN  [SJ_2S-NO-THIN]
JP25  SJ_NO_THIN  [SJ_2S-NO-THIN]
JP26  SJ_NO_THIN  [SJ_2S-NO-THIN]
JP27  SJ_NO_THIN  [SJ_2S-NO-THIN]
JP28  SJ_NO_THIN  [SJ_2S-NO-THIN]
JP29  SJ_NO_THIN  [SJ_2S-NO-THIN]
JP30  SJ_NO_THIN  [SJ_2S-NO-THIN]
JP31  SJ_NO_THIN  [SJ_2S-NO-THIN]
JP32  SJ_NO_THIN  [SJ_2S-NO-THIN]
JP33  SJ_NO_THIN  [SJ_2S-NO-THIN]
JP34  SJ_NO_THIN  [SJ_2S-NO-THIN]
JP35  SJ_NO_THIN  [SJ_2S-NO-THIN]
JP36  SJ_NO_THIN  [SJ_2S-NO-THIN]
JP37  SJ_NO_THIN  [SJ_2S-NO-THIN]
JP38  SJ_NO_THIN  [SJ_2S-NO-THIN]
JP39  SJ_NO_THIN  [SJ_2S-NO-THIN]
JP40  SJ_NO_THIN  [SJ_2S-NO-THIN]
JP41  SJ_NO_THIN  [SJ_2S-NO-THIN]
JP42  SJ_NO_THIN  [SJ_2S-NO-THIN]
JP43  SJ_NO_THIN  [SJ_2S-NO-THIN]
JP44  SJ_NO_THIN  [SJ_2S-NO-THIN]
JP45  SJ_NO_THIN  [SJ_2S-NO-THIN]
JP46  SJ_NO_THIN  [SJ_2S-NO-THIN]
JP47  SJ_NO_THIN  [SJ_2S-NO-THIN]
JP48  SJ_NO_THIN  [SJ_2S-NO-THIN]
JP49  SJ_NO_THIN  [SJ_2S-NO-THIN]
JP50  SJ_NO_THIN  [SJ_2S-NO-THIN]
JP51  SJ_NO_THIN  [SJ_2S-NO-THIN]
JP52  SJ_NO_THIN  [SJ_2S-NO-THIN]
JP53  SJ_NO_THIN  [SJ_2S-NO-THIN]
JP54  SJ_NO_THIN  [SJ_2S-NO-THIN]
JP55  SJ_NO_THIN  [SJ_2S-NO-THIN]
JP56  SJ_NO_THIN  [SJ_2S-NO-THIN]
JP57  SJ_NO_THIN  [SJ_2S-NO-THIN]
JP58  SJ_NO_THIN  [SJ_2S-NO-THIN]
JP59  SJ_NO_THIN  [SJ_2S-NO-THIN]
JP60  SJ_NO_THIN  [SJ_2S-NO-THIN]
JP61  SJ_NO_THIN  [SJ_2S-NO-THIN]
JP62  SJ_NO_THIN  [SJ_2S-NO-THIN]
JP63  SJ_NO_THIN  [SJ_2S-NO-THIN]
JP64  SJ_NO_THIN  [SJ_2S-NO-THIN]
JP65  SJ_NO_THIN  [SJ_2S-NO-THIN]
JP66  SJ_NO_THIN  [SJ_2S-NO-THIN]
JP67  SJ_NO_THIN  [SJ_2S-NO-THIN]
JP68  SJ_NO_THIN  [SJ_2S-NO-THIN]
JP69  SJ_NO_THIN  [SJ_2S-NO-THIN]
JP70  SJ_NO_THIN  [SJ_2S-NO-THIN]
JP71  SJ_NO_THIN  [SJ_2S-NO-THIN]
JP72  SJ_NO_THIN  [SJ_2S-NO-THIN]
JP73  SJ_NO_THIN  [SJ_2S-NO-THIN]
JP74  SJ_NO_THIN  [SJ_2S-NO-THIN]
JP75  SJ_NO_THIN  [SJ_2S-NO-THIN]
JP76  SJ_NO_THIN  [SJ_2S-NO-THIN]
JP77  SJ_NO_THIN  [SJ_2S-NO-THIN]
JP78  SJ_NO_THIN  [SJ_2S-NO-THIN]
JP79  SJ_NO_THIN  [SJ_2S-NO-THIN]
JP80  SJ_NO_THIN  [SJ_2S-NO-THIN]
JP81  SJ_NO_THIN  [SJ_2S-NO-THIN]
JP82  SJ_NO_THIN  [SJ_2S-NO-THIN]
JP83  SJ_NO_THIN  [SJ_2S-NO-THIN]
JP84  SJ_NO_THIN  [SJ_2S-NO-THIN]
JP85  SJ_NO_THIN  [SJ_2S-NO-THIN]
JP86  SJ_NO_THIN  [SJ_2S-NO-THIN]
JP87  SJ_NO_THIN  [SJ_2S-NO-THIN]
JP88  SJ_NO_THIN  [SJ_2S-NO-THIN]
JP89  SJ_NO_THIN  [SJ_2S-NO-THIN]
JP90  SJ_NO_THIN  [SJ_2S-NO-THIN]
JP91  SJ_NO_THIN  [SJ_2S-NO-THIN]
JP92  SJ_NO_THIN  [SJ_2S-NO-THIN]
JP93  SJ_NO_THIN  [SJ_2S-NO-THIN]
JP94  SJ_NO_THIN  [SJ_2S-NO-THIN]
JP95  SJ_NO_THIN  [SJ_2S-NO-THIN]
JP96  SJ_NO_THIN  [SJ_2S-NO-THIN]
JP97  SJ_NO_THIN  [SJ_2S-NO-THIN]
JP98  SJ_NO_THIN  [SJ_2S-NO-THIN]
JP99  SJ_NO_THIN  [SJ_2S-NO-THIN]
JP100  SJ_NO_THIN  [SJ_2S-NO-THIN]
JP101  SJ_NO_THIN  [SJ_2S-NO-THIN]
JP102  SJ_NO_THIN  [SJ_2S-NO-THIN]
JP103  SJ_NO_THIN  [SJ_2S-NO-THIN]
JP104  SJ_NO_THIN  [SJ_2S-NO-THIN]
JP105  SJ_NO_THIN  [SJ_2S-NO-THIN]
JP106  SJ_NO_THIN  [SJ_2S-NO-THIN]
JP107  SJ_NO_THIN  [SJ_2S-NO-THIN]
JP108  SJ_NO_THIN  [SJ_2S-NO-THIN]
JP109  SJ_NO_THIN  [SJ_2S-NO-THIN]
JP110  SJ_NO_THIN  [SJ_2S-NO-THIN]
JP111  SJ_NO_THIN  [SJ_2S-NO-THIN]
JP112  SJ_NO_THIN  [SJ_2S-NO-THIN]
JS2  SJ_NO_THIN  [SJ_2S-NO-THIN]
JS3  SJ_NO_THIN  [SJ_2S-NO-THIN]
JS4  SJ_NO_THIN  [SJ_2S-NO-THIN]
JS5  SJ_NO_THIN  [SJ_2S-NO-THIN]
JS21  SJ_NO_THIN  [SJ_2S-NO-THIN]
JS22  SJ_NO_THIN  [SJ_2S-NO-THIN]
JS23  SJ_NO_THIN  [SJ_2S-NO-THIN]
JS24  SJ_NO_THIN  [SJ_2S-NO-THIN]
JS25  SJ_NO_THIN  [SJ_2S-NO-THIN]
JS26  SJ_NO_THIN  [SJ_2S-NO-THIN]
JS27  SJ_NO_THIN  [SJ_2S-NO-THIN]
JS28  SJ_NO_THIN  [SJ_2S-NO-THIN]
JS29  SJ_NO_THIN  [SJ_2S-NO-THIN]
JS30  SJ_NO_THIN  [SJ_2S-NO-THIN]
JS31  SJ_NO_THIN  [SJ_2S-NO-THIN]
JS32  SJ_NO_THIN  [SJ_2S-NO-THIN]
JS33  SJ_NO_THIN  [SJ_2S-NO-THIN]
JS34  SJ_NO_THIN  [SJ_2S-NO-THIN]
JS35  SJ_NO_THIN  [SJ_2S-NO-THIN]
JS36  SJ_NO_THIN  [SJ_2S-NO-THIN]
JS37  SJ_NO_THIN  [SJ_2S-NO-THIN]
JS38  SJ_NO_THIN  [SJ_2S-NO-THIN]
JS39  SJ_NO_THIN  [SJ_2S-NO-THIN]
JS40  SJ_NO_THIN  [SJ_2S-NO-THIN]
JS41  SJ_NO_THIN  [SJ_2S-NO-THIN]
JS42  SJ_NO_THIN  [SJ_2S-NO-THIN]
JS43  SJ_NO_THIN  [SJ_2S-NO-THIN]
JS44  SJ_NO_THIN  [SJ_2S-NO-THIN]
JS45  SJ_NO_THIN  [SJ_2S-NO-THIN]
JS46  SJ_NO_THIN  [SJ_2S-NO-THIN]
JS47  SJ_NO_THIN  [SJ_2S-NO-THIN]
JS48  SJ_NO_THIN  [SJ_2S-NO-THIN]
JS49  SJ_NO_THIN  [SJ_2S-NO-THIN]
JS50  SJ_NO_THIN  [SJ_2S-NO-THIN]
JS51  SJ_NO_THIN  [SJ_2S-NO-THIN]
JS52  SJ_NO_THIN  [SJ_2S-NO-THIN]
JS53  SJ_NO_THIN  [SJ_2S-NO-THIN]
JS54  SJ_NO_THIN  [SJ_2S-NO-THIN]
JS55  SJ_NO_THIN  [SJ_2S-NO-THIN]
JS56  SJ_NO_THIN  [SJ_2S-NO-THIN]
JS57  SJ_NO_THIN  [SJ_2S-NO-THIN]
JS58  SJ_NO_THIN  [SJ_2S-NO-THIN]
JS59  SJ_NO_THIN  [SJ_2S-NO-THIN]
JS60  SJ_NO_THIN  [SJ_2S-NO-THIN]
JS61  SJ_NO_THIN  [SJ_2S-NO-THIN]
JS62  SJ_NO_THIN  [SJ_2S-NO-THIN]
JS63  SJ_NO_THIN  [SJ_2S-NO-THIN]
JS64  SJ_NO_THIN  [SJ_2S-NO-THIN]
JS65  SJ_NO_THIN  [SJ_2S-NO-THIN]
JS66  SJ_NO_THIN  [SJ_2S-NO-THIN]
JS67  SJ_NO_THIN  [SJ_2S-NO-THIN]
JS68  SJ_NO_THIN  [SJ_2S-NO-THIN]
JS69  SJ_NO_THIN  [SJ_2S-NO-THIN]
JS70  SJ_NO_THIN  [SJ_2S-NO-THIN]
JS71  SJ_NO_THIN  [SJ_2S-NO-THIN]
JS72  SJ_NO_THIN  [SJ_2S-NO-THIN]
JS73  SJ_NO_THIN  [SJ_2S-NO-THIN]
JS74  SJ_NO_THIN  [SJ_2S-NO-THIN]
JS75  SJ_NO_THIN  [SJ_2S-NO-THIN]
JS76  SJ_NO_THIN  [SJ_2S-NO-THIN]
JS77  SJ_NO_THIN  [SJ_2S-NO-THIN]
JS78  SJ_NO_THIN  [SJ_2S-NO-THIN]
JS79  SJ_NO_THIN  [SJ_2S-NO-THIN]
JS80  SJ_NO_THIN  [SJ_2S-NO-THIN]
JS81  SJ_NO_THIN  [SJ_2S-NO-THIN]
JS82  SJ_NO_THIN  [SJ_2S-NO-THIN]
JS83  SJ_NO_THIN  [SJ_2S-NO-THIN]
JS84  SJ_NO_THIN  [SJ_2S-NO-THIN]
JS85  SJ_NO_THIN  [SJ_2S-NO-THIN]
JS86  SJ_NO_THIN  [SJ_2S-NO-THIN]
JS87  SJ_NO_THIN  [SJ_2S-NO-THIN]
JS88  SJ_NO_THIN  [SJ_2S-NO-THIN]
JS89  SJ_NO_THIN  [SJ_2S-NO-THIN]
JS90  SJ_NO_THIN  [SJ_2S-NO-THIN]
JS91  SJ_NO_THIN  [SJ_2S-NO-THIN]
JS92  SJ_NO_THIN  [SJ_2S-NO-THIN]
JS93  SJ_NO_THIN  [SJ_2S-NO-THIN]
JS94  SJ_NO_THIN  [SJ_2S-NO-THIN]
JS95  SJ_NO_THIN  [SJ_2S-NO-THIN]
JS96  SJ_NO_THIN  [SJ_2S-NO-THIN]
JS97  SJ_NO_THIN  [SJ_2S-NO-THIN]
JS98  SJ_NO_THIN  [SJ_2S-NO-THIN]
JS99  SJ_NO_THIN  [SJ_2S-NO-THIN]
JS100  SJ_NO_THIN  [SJ_2S-NO-THIN]
JS101  SJ_NO_THIN  [SJ_2S-NO-THIN]
JS102  SJ_NO_THIN  [SJ_2S-NO-THIN]
JS103  SJ_NO_THIN  [SJ_2S-NO-THIN]
JS104  SJ_NO_THIN  [SJ_2S-NO-THIN]
JS105  SJ_NO_THIN  [SJ_2S-NO-THIN]
JS106  SJ_NO_THIN  [SJ_2S-NO-THIN]
JS107  SJ_NO_THIN  [SJ_2S-NO-THIN]
JS108  SJ_NO_THIN  [SJ_2S-NO-THIN]
JS109  SJ_NO_THIN  [SJ_2S-NO-THIN]
JS110  SJ_NO_THIN  [SJ_2S-NO-THIN]
JS111  SJ_NO_THIN  [SJ_2S-NO-THIN]
JS112  SJ_NO_THIN  [SJ_2S-NO-THIN]
Q25  2N7002  [SOT23]
Q26  2N7002  [SOT23]
Q27  2N7002  [SOT23]
Q28  2N7002  [SOT23]
Q29  2N7002  [SOT23]
Q30  2N7002  [SOT23]
Q31  2N7002  [SOT23]
Q32  2N7002  [SOT23]
Q33  2N7002  [SOT23]
Q34  2N7002  [SOT23]
Q35  2N7002  [SOT23]
Q36  2N7002  [SOT23]
Q37  2N7002  [SOT23]
Q38  2N7002  [SOT23]
Q39  2N7002  [SOT23]
Q40  2N7002  [SOT23]
Q41  2N7002  [SOT23]
Q42  2N7002  [SOT23]
Q43  2N7002  [SOT23]
Q44  2N7002  [SOT23]
Q45  2N7002  [SOT23]
Q46  2N7002  [SOT23]
Q47  2N7002  [SOT23]
Q48  2N7002  [SOT23]
Q49  2N7002  [SOT23]
Q50  2N7002  [SOT23]
Q51  2N7002  [SOT23]
Q52  2N7002  [SOT23]
Q53  2N7002  [SOT23]
Q54  2N7002  [SOT23]
Q55  2N7002  [SOT23]
Q56  2N7002  [SOT23]
Q57  2N7002  [SOT23]
Q58  2N7002  [SOT23]
Q59  2N7002  [SOT23]
Q60  2N7002  [SOT23]
Q61  2N7002  [SOT23]
Q62  2N7002  [SOT23]
Q63  2N7002  [SOT23]
Q64  2N7002  [SOT23]
Q65  2N7002  [SOT23]
Q66  2N7002  [SOT23]
Q67  2N7002  [SOT23]
Q68  2N7002  [SOT23]
Q69  2N7002  [SOT23]
Q70  2N7002  [SOT23]
Q71  2N7002  [SOT23]
Q72  2N7002  [SOT23]
Q73  2N7002  [SOT23]
Q74  2N7002  [SOT23]
Q75  2N7002  [SOT23]
Q76  2N7002  [SOT23]
Q77  2N7002  [SOT23]
Q78  2N7002  [SOT23]
Q79  2N7002  [SOT23]
Q80  2N7002  [SOT23]
Q81  2N7002  [SOT23]
Q82  2N7002  [SOT23]
Q83  2N7002  [SOT23]
Q84  2N7002  [SOT23]
Q85  2N7002  [SOT23]
Q86  2N7002  [SOT23]
Q87  2N7002  [SOT23]
Q88  2N7002  [SOT23]
Q89  2N7002  [SOT23]
Q90  2N7002  [SOT23]
Q91  2N7002  [SOT23]
Q92  2N7002  [SOT23]
Q93  2N7002  [SOT23]
Q94  2N7002  [SOT23]
Q95  2N7002  [SOT23]
Q96  2N7002  [SOT23]
Q97  2N7002  [SOT23]
Q98  2N7002  [SOT23]
Q99  2N7002  [SOT23]
Q100  2N7002  [SOT23]
Q101  2N7002  [SOT23]
Q102  2N7002  [SOT23]
Q103  2N7002  [SOT23]
Q104  2N7002  [SOT23]
Q105  2N7002  [SOT23]
Q106  2N7002  [SOT23]
Q107  2N7002  [SOT23]
Q108  2N7002  [SOT23]
Q109  2N7002  [SOT23]
Q110  2N7002  [SOT23]
Q111  2N7002  [SOT23]
Q112  2N7002  [SOT23]
Q113  2N7002  [SOT23]
Q114  2N7002  [SOT23]
Q115  2N7002  [SOT23]
Q116  2N7002  [SOT23]
Q117  2N7002  [SOT23]
Q118  2N7002  [SOT23]
Q119  2N7002  [SOT23]
Q120  2N7002  [SOT23]
R25  10k  RES0603  [R0603]
R26  10k  RES0603  [R0603]
R27  10k  RES0603  [R0603]
R28  10k  RES0603  [R0603]
R29  10k  RES0603  [R0603]
R30  10k  RES0603  [R0603]
R31  10k  RES0603  [R0603]
R32  10k  RES0603  [R0603]
R33  10k  RES0603  [R0603]
R34  10k  RES0603  [R0603]
R35  10k  RES0603  [R0603]
R36  10k  RES0603  [R0603]
R37  10k  RES0603  [R0603]
R38  10k  RES0603  [R0603]
R39  10k  RES0603  [R0603]
R40  10k  RES0603  [R0603]
R41  10k  RES0603  [R0603]
R42  10k  RES0603  [R0603]
R43  10k  RES0603  [R0603]
R44  10k  RES0603  [R0603]
R45  10k  RES0603  [R0603]
R46  10k  RES0603  [R0603]
R47  10k  RES0603  [R0603]
R48  10k  RES0603  [R0603]
R49  10k  RES0603  [R0603]
R50  10k  RES0603  [R0603]
R51  10k  RES0603  [R0603]
R52  10k  RES0603  [R0603]
R53  10k  RES0603  [R0603]
R54  10k  RES0603  [R0603]
R55  10k  RES0603  [R0603]
R56  10k  RES0603  [R0603]
R57  10k  RES0603  [R0603]
R58  10k  RES0603  [R0603]
R59  10k  RES0603  [R0603]
R60  10k  RES0603  [R0603]
R61  10k  RES0603  [R0603]
R62  10k  RES0603  [R0603]
R63  10k  RES0603  [R0603]
R64  10k  RES0603  [R0603]
R65  10k  RES0603  [R0603]
R66  10k  RES0603  [R0603]
R67  10k  RES0603  [R0603]
R68  10k  RES0603  [R0603]
R69  10k  RES0603  [R0603]
R70  10k  RES0603  [R0603]
R71  10k  RES0603  [R0603]
R72  10k  RES0603  [R0603]
R73  10k  RES0603  [R0603]
R74  10k  RES0603  [R0603]
R79  10k  RES0603  [R0603]
R80  10k  RES0603  [R0603]
R83  10k  RES0603  [R0603]
R84  10k  RES0603  [R0603]
R87  10k  RES0603  [R0603]
R88  10k  RES0603  [R0603]
R91  10k  RES0603  [R0603]
R92  10k  RES0603  [R0603]
R95  10k  RES0603  [R0603]
R96  10k  RES0603  [R0603]
R97  10k  RES0603  [R0603]
R98  10k  RES0603  [R0603]
R99  10k  RES0603  [R0603]
R100  10k  RES0603  [R0603]
R101  10k  RES0603  [R0603]
R102  10k  RES0603  [R0603]
R103  10k  RES0603  [R0603]
R104  10k  RES0603  [R0603]
R105  10k  RES0603  [R0603]
R106  10k  RES0603  [R0603]
R107  10k  RES0603  [R0603]
R108  10k  RES0603  [R0603]
R109  10k  RES0603  [R0603]
R110  10k  RES0603  [R0603]
R111  10k  RES0603  [R0603]
R112  10k  RES0603  [R0603]
R113  10k  RES0603  [R0603]
R114  10k  RES0603  [R0603]
R115  10k  RES0603  [R0603]
R116  10k  RES0603  [R0603]
R117  10k  RES0603  [R0603]
R118  10k  RES0603  [R0603]
R119  10k  RES0603  [R0603]
R120  10k  RES0603  [R0603]
R121  10k  RES0603  [R0603]
R122  10k  RES0603  [R0603]
R123  10k  RES0603  [R0603]
R124  10k  RES0603  [R0603]
R125  10k  RES0603  [R0603]
R126  10k  RES0603  [R0603]
R127  10k  RES0603  [R0603]
R128  10k  RES0603  [R0603]
R129  10k  RES0603  [R0603]
R130  10k  RES0603  [R0603]
R131  10k  RES0603  [R0603]
R132  10k  RES0603  [R0603]
SOURCEA2  TPTHT  [PROTOPAD-THT-PAD]
SOURCEA3  TPTHT  [PROTOPAD-THT-PAD]
SOURCEA4  TPTHT  [PROTOPAD-THT-PAD]
SOURCEA5  TPTHT  [PROTOPAD-THT-PAD]
SOURCEA21  TPTHT  [PROTOPAD-THT-PAD]
SOURCEA22  TPTHT  [PROTOPAD-THT-PAD]
SOURCEA23  TPTHT  [PROTOPAD-THT-PAD]
SOURCEA24  TPTHT  [PROTOPAD-THT-PAD]
SOURCEA25  TPTHT  [PROTOPAD-THT-PAD]
SOURCEA26  TPTHT  [PROTOPAD-THT-PAD]
SOURCEA27  TPTHT  [PROTOPAD-THT-PAD]
SOURCEA28  TPTHT  [PROTOPAD-THT-PAD]
SOURCEA29  TPTHT  [PROTOPAD-THT-PAD]
SOURCEA30  TPTHT  [PROTOPAD-THT-PAD]
SOURCEA31  TPTHT  [PROTOPAD-THT-PAD]
SOURCEA32  TPTHT  [PROTOPAD-THT-PAD]
SOURCEA33  TPTHT  [PROTOPAD-THT-PAD]
SOURCEA34  TPTHT  [PROTOPAD-THT-PAD]
SOURCEA35  TPTHT  [PROTOPAD-THT-PAD]
SOURCEA36  TPTHT  [PROTOPAD-THT-PAD]
SOURCEA37  TPTHT  [PROTOPAD-THT-PAD]
SOURCEA38  TPTHT  [PROTOPAD-THT-PAD]
SOURCEA39  TPTHT  [PROTOPAD-THT-PAD]
SOURCEA40  TPTHT  [PROTOPAD-THT-PAD]
SOURCEA41  TPTHT  [PROTOPAD-THT-PAD]
SOURCEA42  TPTHT  [PROTOPAD-THT-PAD]
SOURCEA43  TPTHT  [PROTOPAD-THT-PAD]
SOURCEA44  TPTHT  [PROTOPAD-THT-PAD]
SOURCEA45  TPTHT  [PROTOPAD-THT-PAD]
SOURCEA46  TPTHT  [PROTOPAD-THT-PAD]
SOURCEA47  TPTHT  [PROTOPAD-THT-PAD]
SOURCEA48  TPTHT  [PROTOPAD-THT-PAD]
SOURCEA49  TPTHT  [PROTOPAD-THT-PAD]
SOURCEA50  TPTHT  [PROTOPAD-THT-PAD]
SOURCEA51  TPTHT  [PROTOPAD-THT-PAD]
SOURCEA52  TPTHT  [PROTOPAD-THT-PAD]
SOURCEA53  TPTHT  [PROTOPAD-THT-PAD]
SOURCEA54  TPTHT  [PROTOPAD-THT-PAD]
SOURCEA55  TPTHT  [PROTOPAD-THT-PAD]
SOURCEA56  TPTHT  [PROTOPAD-THT-PAD]
SOURCEA57  TPTHT  [PROTOPAD-THT-PAD]
SOURCEA58  TPTHT  [PROTOPAD-THT-PAD]
SOURCEA59  TPTHT  [PROTOPAD-THT-PAD]
SOURCEA60  TPTHT  [PROTOPAD-THT-PAD]
SOURCEA61  TPTHT  [PROTOPAD-THT-PAD]
SOURCEA62  TPTHT  [PROTOPAD-THT-PAD]
SOURCEA63  TPTHT  [PROTOPAD-THT-PAD]
SOURCEA64  TPTHT  [PROTOPAD-THT-PAD]
SOURCEA65  TPTHT  [PROTOPAD-THT-PAD]
SOURCEA66  TPTHT  [PROTOPAD-THT-PAD]
SOURCEA67  TPTHT  [PROTOPAD-THT-PAD]
SOURCEA68  TPTHT  [PROTOPAD-THT-PAD]
SOURCEA69  TPTHT  [PROTOPAD-THT-PAD]
SOURCEA70  TPTHT  [PROTOPAD-THT-PAD]
SOURCEA71  TPTHT  [PROTOPAD-THT-PAD]
SOURCEA72  TPTHT  [PROTOPAD-THT-PAD]
SOURCEA73  TPTHT  [PROTOPAD-THT-PAD]
SOURCEA74  TPTHT  [PROTOPAD-THT-PAD]
SOURCEA75  TPTHT  [PROTOPAD-THT-PAD]
SOURCEA76  TPTHT  [PROTOPAD-THT-PAD]
SOURCEA77  TPTHT  [PROTOPAD-THT-PAD]
SOURCEA78  TPTHT  [PROTOPAD-THT-PAD]
SOURCEA79  TPTHT  [PROTOPAD-THT-PAD]
SOURCEA80  TPTHT  [PROTOPAD-THT-PAD]
SOURCEA81  TPTHT  [PROTOPAD-THT-PAD]
SOURCEA82  TPTHT  [PROTOPAD-THT-PAD]
SOURCEA83  TPTHT  [PROTOPAD-THT-PAD]
SOURCEA84  TPTHT  [PROTOPAD-THT-PAD]
SOURCEA85  TPTHT  [PROTOPAD-THT-PAD]
SOURCEA86  TPTHT  [PROTOPAD-THT-PAD]
SOURCEA87  TPTHT  [PROTOPAD-THT-PAD]
SOURCEA88  TPTHT  [PROTOPAD-THT-PAD]
SOURCEA89  TPTHT  [PROTOPAD-THT-PAD]
SOURCEA90  TPTHT  [PROTOPAD-THT-PAD]
SOURCEA91  TPTHT  [PROTOPAD-THT-PAD]
SOURCEA92  TPTHT  [PROTOPAD-THT-PAD]
SOURCEA93  TPTHT  [PROTOPAD-THT-PAD]
SOURCEA94  TPTHT  [PROTOPAD-THT-PAD]
SOURCEA95  TPTHT  [PROTOPAD-THT-PAD]
SOURCEA96  TPTHT  [PROTOPAD-THT-PAD]
SOURCEA97  TPTHT  [PROTOPAD-THT-PAD]
SOURCEA98  TPTHT  [PROTOPAD-THT-PAD]
SOURCEA99  TPTHT  [PROTOPAD-THT-PAD]
SOURCEA100  TPTHT  [PROTOPAD-THT-PAD]
SOURCEA101  TPTHT  [PROTOPAD-THT-PAD]
SOURCEA102  TPTHT  [PROTOPAD-THT-PAD]
SOURCEA103  TPTHT  [PROTOPAD-THT-PAD]
SOURCEA104  TPTHT  [PROTOPAD-THT-PAD]
SOURCEA105  TPTHT  [PROTOPAD-THT-PAD]
SOURCEA106  TPTHT  [PROTOPAD-THT-PAD]
SOURCEA107  TPTHT  [PROTOPAD-THT-PAD]
SOURCEA108  TPTHT  [PROTOPAD-THT-PAD]
SOURCEA109  TPTHT  [PROTOPAD-THT-PAD]
SOURCEA110  TPTHT  [PROTOPAD-THT-PAD]
SOURCEA111  TPTHT  [PROTOPAD-THT-PAD]
SOURCEA112  TPTHT  [PROTOPAD-THT-PAD]
SOURCEB2  TPTHT  [PROTOPAD-THT-PAD]
SOURCEB3  TPTHT  [PROTOPAD-THT-PAD]
SOURCEB4  TPTHT  [PROTOPAD-THT-PAD]
SOURCEB5  TPTHT  [PROTOPAD-THT-PAD]
SOURCEB21  TPTHT  [PROTOPAD-THT-PAD]
SOURCEB22  TPTHT  [PROTOPAD-THT-PAD]
SOURCEB23  TPTHT  [PROTOPAD-THT-PAD]
SOURCEB24  TPTHT  [PROTOPAD-THT-PAD]
SOURCEB25  TPTHT  [PROTOPAD-THT-PAD]
SOURCEB26  TPTHT  [PROTOPAD-THT-PAD]
SOURCEB27  TPTHT  [PROTOPAD-THT-PAD]
SOURCEB28  TPTHT  [PROTOPAD-THT-PAD]
SOURCEB29  TPTHT  [PROTOPAD-THT-PAD]
SOURCEB30  TPTHT  [PROTOPAD-THT-PAD]
SOURCEB31  TPTHT  [PROTOPAD-THT-PAD]
SOURCEB32  TPTHT  [PROTOPAD-THT-PAD]
SOURCEB33  TPTHT  [PROTOPAD-THT-PAD]
SOURCEB34  TPTHT  [PROTOPAD-THT-PAD]
SOURCEB35  TPTHT  [PROTOPAD-THT-PAD]
SOURCEB36  TPTHT  [PROTOPAD-THT-PAD]
SOURCEB37  TPTHT  [PROTOPAD-THT-PAD]
SOURCEB38  TPTHT  [PROTOPAD-THT-PAD]
SOURCEB39  TPTHT  [PROTOPAD-THT-PAD]
SOURCEB40  TPTHT  [PROTOPAD-THT-PAD]
SOURCEB41  TPTHT  [PROTOPAD-THT-PAD]
SOURCEB42  TPTHT  [PROTOPAD-THT-PAD]
SOURCEB43  TPTHT  [PROTOPAD-THT-PAD]
SOURCEB44  TPTHT  [PROTOPAD-THT-PAD]
SOURCEB45  TPTHT  [PROTOPAD-THT-PAD]
SOURCEB46  TPTHT  [PROTOPAD-THT-PAD]
SOURCEB47  TPTHT  [PROTOPAD-THT-PAD]
SOURCEB48  TPTHT  [PROTOPAD-THT-PAD]
SOURCEB49  TPTHT  [PROTOPAD-THT-PAD]
SOURCEB50  TPTHT  [PROTOPAD-THT-PAD]
SOURCEB51  TPTHT  [PROTOPAD-THT-PAD]
SOURCEB52  TPTHT  [PROTOPAD-THT-PAD]
SOURCEB53  TPTHT  [PROTOPAD-THT-PAD]
SOURCEB54  TPTHT  [PROTOPAD-THT-PAD]
SOURCEB55  TPTHT  [PROTOPAD-THT-PAD]
SOURCEB56  TPTHT  [PROTOPAD-THT-PAD]
SOURCEB57  TPTHT  [PROTOPAD-THT-PAD]
SOURCEB58  TPTHT  [PROTOPAD-THT-PAD]
SOURCEB59  TPTHT  [PROTOPAD-THT-PAD]
SOURCEB60  TPTHT  [PROTOPAD-THT-PAD]
SOURCEB61  TPTHT  [PROTOPAD-THT-PAD]
SOURCEB62  TPTHT  [PROTOPAD-THT-PAD]
SOURCEB63  TPTHT  [PROTOPAD-THT-PAD]
SOURCEB64  TPTHT  [PROTOPAD-THT-PAD]
SOURCEB65  TPTHT  [PROTOPAD-THT-PAD]
SOURCEB66  TPTHT  [PROTOPAD-THT-PAD]
SOURCEB67  TPTHT  [PROTOPAD-THT-PAD]
SOURCEB68  TPTHT  [PROTOPAD-THT-PAD]
SOURCEB69  TPTHT  [PROTOPAD-THT-PAD]
SOURCEB70  TPTHT  [PROTOPAD-THT-PAD]
SOURCEB71  TPTHT  [PROTOPAD-THT-PAD]
SOURCEB72  TPTHT  [PROTOPAD-THT-PAD]
SOURCEB73  TPTHT  [PROTOPAD-THT-PAD]
SOURCEB74  TPTHT  [PROTOPAD-THT-PAD]
SOURCEB75  TPTHT  [PROTOPAD-THT-PAD]
SOURCEB76  TPTHT  [PROTOPAD-THT-PAD]
SOURCEB77  TPTHT  [PROTOPAD-THT-PAD]
SOURCEB78  TPTHT  [PROTOPAD-THT-PAD]
SOURCEB79  TPTHT  [PROTOPAD-THT-PAD]
SOURCEB80  TPTHT  [PROTOPAD-THT-PAD]
SOURCEB81  TPTHT  [PROTOPAD-THT-PAD]
SOURCEB82  TPTHT  [PROTOPAD-THT-PAD]
SOURCEB83  TPTHT  [PROTOPAD-THT-PAD]
SOURCEB84  TPTHT  [PROTOPAD-THT-PAD]
SOURCEB85  TPTHT  [PROTOPAD-THT-PAD]
SOURCEB86  TPTHT  [PROTOPAD-THT-PAD]
SOURCEB87  TPTHT  [PROTOPAD-THT-PAD]
SOURCEB88  TPTHT  [PROTOPAD-THT-PAD]
SOURCEB89  TPTHT  [PROTOPAD-THT-PAD]
SOURCEB90  TPTHT  [PROTOPAD-THT-PAD]
SOURCEB91  TPTHT  [PROTOPAD-THT-PAD]
SOURCEB92  TPTHT  [PROTOPAD-THT-PAD]
SOURCEB93  TPTHT  [PROTOPAD-THT-PAD]
SOURCEB94  TPTHT  [PROTOPAD-THT-PAD]
SOURCEB95  TPTHT  [PROTOPAD-THT-PAD]
SOURCEB96  TPTHT  [PROTOPAD-THT-PAD]
SOURCEB97  TPTHT  [PROTOPAD-THT-PAD]
SOURCEB98  TPTHT  [PROTOPAD-THT-PAD]
SOURCEB99  TPTHT  [PROTOPAD-THT-PAD]
SOURCEB100  TPTHT  [PROTOPAD-THT-PAD]
SOURCEB101  TPTHT  [PROTOPAD-THT-PAD]
SOURCEB102  TPTHT  [PROTOPAD-THT-PAD]
SOURCEB103  TPTHT  [PROTOPAD-THT-PAD]
SOURCEB104  TPTHT  [PROTOPAD-THT-PAD]
SOURCEB105  TPTHT  [PROTOPAD-THT-PAD]
SOURCEB106  TPTHT  [PROTOPAD-THT-PAD]
SOURCEB107  TPTHT  [PROTOPAD-THT-PAD]
SOURCEB108  TPTHT  [PROTOPAD-THT-PAD]
SOURCEB109  TPTHT  [PROTOPAD-THT-PAD]
SOURCEB110  TPTHT  [PROTOPAD-THT-PAD]
SOURCEB111  TPTHT  [PROTOPAD-THT-PAD]
SOURCEB112  TPTHT  [PROTOPAD-THT-PAD]

### Nets
GND: JN2.1 JN3.1 JN4.1 JN5.1 JN21.1 JN22.1 JN23.1 JN24.1 JN25.1 JN26.1 JN27.1 JN28.1 JN29.1 JN30.1 JN31.1 JN32.1 JN33.1 JN34.1 JN35.1 JN36.1 JN37.1 JN38.1 JN39.1 JN40.1 JN41.1 JN42.1 JN43.1 JN44.1 JN45.1 JN46.1 JN47.1 JN48.1 JN49.1 JN50.1 JN51.1 JN52.1 JN53.1 JN54.1 JN55.1 JN56.1 JN57.1 JN58.1 JN59.1 JN60.1 JN61.1 JN62.1 JN63.1 JN64.1 JN65.1 JN66.1 JN67.1 JN68.1 JN69.1 JN70.1 JN71.1 JN72.1 JN73.1 JN74.1 JN75.1 JN76.1 JN77.1 JN78.1 JN79.1 JN80.1 JN81.1 JN82.1 JN83.1 JN84.1 JN85.1 JN86.1 JN87.1 JN88.1 JN89.1 JN90.1 JN91.1 JN92.1 JN93.1 JN94.1 JN95.1 JN96.1 JN97.1 JN98.1 JN99.1 JN100.1 JN101.1 JN102.1 JN103.1 JN104.1 JN105.1 JN106.1 JN107.1 JN108.1 JN109.1 JN110.1 JN111.1 JN112.1 ; also sheet 2
N$92: JP2.2 R25.1
N$93: JN2.2 JS2.2 Q25.2(S) SOURCEA2.P1(S) SOURCEB2.P1(S)
N$94: DRAINA2.P1(S) DRAINB2.P1(S) JD2.2 JP2.1 JS49.1 Q25.3(D)
N$95: GATEA2.P1(S) GATEB2.P1(S) Q25.1(G)
N$96: JP3.2 R26.1
N$97: JN3.2 JS3.2 Q26.2(S) SOURCEA3.P1(S) SOURCEB3.P1(S)
N$98: DRAINA3.P1(S) DRAINB3.P1(S) JD2.1 JD3.2 JP3.1 JS50.1 Q26.3(D)
N$99: GATEA3.P1(S) GATEB3.P1(S) Q26.1(G)
N$100: JP4.2 R27.1
N$101: JN4.2 JS4.2 Q27.2(S) SOURCEA4.P1(S) SOURCEB4.P1(S)
N$102: DRAINA4.P1(S) DRAINB4.P1(S) JD3.1 JD4.2 JP4.1 JS51.1 Q27.3(D)
N$103: GATEA4.P1(S) GATEB4.P1(S) Q27.1(G)
N$104: JP5.2 R28.1
N$105: JN5.2 JS5.2 Q28.2(S) SOURCEA5.P1(S) SOURCEB5.P1(S)
N$106: DRAINA5.P1(S) DRAINB5.P1(S) JD4.1 JD5.2 JP5.1 JS52.1 Q28.3(D)
N$107: GATEA5.P1(S) GATEB5.P1(S) Q28.1(G)
N$108: JP21.2 R29.1
N$109: JN21.2 JS21.2 Q29.2(S) SOURCEA21.P1(S) SOURCEB21.P1(S)
N$110: DRAINA21.P1(S) DRAINB21.P1(S) JD5.1 JD21.2 JP21.1 JS53.1 Q29.3(D)
N$111: GATEA21.P1(S) GATEB21.P1(S) Q29.1(G)
N$112: JP22.2 R30.1
N$113: JN22.2 JS22.2 Q30.2(S) SOURCEA22.P1(S) SOURCEB22.P1(S)
N$114: DRAINA22.P1(S) DRAINB22.P1(S) JD21.1 JD22.2 JP22.1 JS54.1 Q30.3(D)
N$115: GATEA22.P1(S) GATEB22.P1(S) Q30.1(G)
N$116: JP23.2 R31.1
N$117: JN23.2 JS23.2 Q31.2(S) SOURCEA23.P1(S) SOURCEB23.P1(S)
N$118: DRAINA23.P1(S) DRAINB23.P1(S) JD22.1 JD23.2 JP23.1 JS55.1 Q31.3(D)
N$119: GATEA23.P1(S) GATEB23.P1(S) Q31.1(G)
N$120: JP24.2 R32.1
N$121: JN24.2 JS24.2 Q32.2(S) SOURCEA24.P1(S) SOURCEB24.P1(S)
N$122: DRAINA24.P1(S) DRAINB24.P1(S) JD23.1 JD24.2 JP24.1 JS56.1 Q32.3(D)
N$123: GATEA24.P1(S) GATEB24.P1(S) Q32.1(G)
N$124: JP25.2 R33.1
N$125: JN25.2 JS25.2 Q33.2(S) SOURCEA25.P1(S) SOURCEB25.P1(S)
N$126: DRAINA25.P1(S) DRAINB25.P1(S) JD24.1 JD25.2 JP25.1 JS57.1 Q33.3(D)
N$127: GATEA25.P1(S) GATEB25.P1(S) Q33.1(G)
N$128: JP26.2 R34.1
N$129: JN26.2 JS26.2 Q34.2(S) SOURCEA26.P1(S) SOURCEB26.P1(S)
N$130: DRAINA26.P1(S) DRAINB26.P1(S) JD25.1 JD26.2 JP26.1 JS58.1 Q34.3(D)
N$131: GATEA26.P1(S) GATEB26.P1(S) Q34.1(G)
N$132: JP27.2 R35.1
N$133: JN27.2 JS27.2 Q35.2(S) SOURCEA27.P1(S) SOURCEB27.P1(S)
N$134: DRAINA27.P1(S) DRAINB27.P1(S) JD26.1 JD27.2 JP27.1 JS59.1 Q35.3(D)
N$135: GATEA27.P1(S) GATEB27.P1(S) Q35.1(G)
N$136: JP28.2 R36.1
N$137: JN28.2 JS28.2 Q36.2(S) SOURCEA28.P1(S) SOURCEB28.P1(S)
N$138: DRAINA28.P1(S) DRAINB28.P1(S) JD27.1 JD28.2 JP28.1 JS60.1 Q36.3(D)
N$139: GATEA28.P1(S) GATEB28.P1(S) Q36.1(G)
N$140: JP29.2 R37.1
N$141: JN29.2 JS29.2 Q37.2(S) SOURCEA29.P1(S) SOURCEB29.P1(S)
N$142: DRAINA29.P1(S) DRAINB29.P1(S) JD28.1 JD29.2 JP29.1 JS61.1 Q37.3(D)
N$143: GATEA29.P1(S) GATEB29.P1(S) Q37.1(G)
N$144: JP30.2 R38.1
N$145: JN30.2 JS30.2 Q38.2(S) SOURCEA30.P1(S) SOURCEB30.P1(S)
N$146: DRAINA30.P1(S) DRAINB30.P1(S) JD29.1 JD30.2 JP30.1 JS62.1 Q38.3(D)
N$147: GATEA30.P1(S) GATEB30.P1(S) Q38.1(G)
N$148: JP31.2 R39.1
N$149: JN31.2 JS31.2 Q39.2(S) SOURCEA31.P1(S) SOURCEB31.P1(S)
N$150: DRAINA31.P1(S) DRAINB31.P1(S) JD30.1 JD31.2 JP31.1 JS63.1 Q39.3(D)
N$151: GATEA31.P1(S) GATEB31.P1(S) Q39.1(G)
N$152: JP32.2 R40.1
N$153: JN32.2 JS32.2 Q40.2(S) SOURCEA32.P1(S) SOURCEB32.P1(S)
N$154: DRAINA32.P1(S) DRAINB32.P1(S) JD31.1 JD32.2 JP32.1 JS64.1 Q40.3(D)
N$155: GATEA32.P1(S) GATEB32.P1(S) Q40.1(G)
N$156: JP33.2 R41.1
N$157: JN33.2 JS33.2 Q41.2(S) SOURCEA33.P1(S) SOURCEB33.P1(S)
N$158: DRAINA33.P1(S) DRAINB33.P1(S) JD33.2 JP33.1 JS2.1 Q41.3(D)
N$159: GATEA33.P1(S) GATEB33.P1(S) Q41.1(G)
N$160: JP34.2 R42.1
N$161: JN34.2 JS34.2 Q42.2(S) SOURCEA34.P1(S) SOURCEB34.P1(S)
N$162: DRAINA34.P1(S) DRAINB34.P1(S) JD33.1 JD34.2 JP34.1 JS3.1 Q42.3(D)
N$163: GATEA34.P1(S) GATEB34.P1(S) Q42.1(G)
N$164: JP35.2 R43.1
N$165: JN35.2 JS35.2 Q43.2(S) SOURCEA35.P1(S) SOURCEB35.P1(S)
N$166: DRAINA35.P1(S) DRAINB35.P1(S) JD34.1 JD35.2 JP35.1 JS4.1 Q43.3(D)
N$167: GATEA35.P1(S) GATEB35.P1(S) Q43.1(G)
N$168: JP36.2 R44.1
N$169: JN36.2 JS36.2 Q44.2(S) SOURCEA36.P1(S) SOURCEB36.P1(S)
N$170: DRAINA36.P1(S) DRAINB36.P1(S) JD35.1 JD36.2 JP36.1 JS5.1 Q44.3(D)
N$171: GATEA36.P1(S) GATEB36.P1(S) Q44.1(G)
N$172: JP37.2 R45.1
N$173: JN37.2 JS37.2 Q45.2(S) SOURCEA37.P1(S) SOURCEB37.P1(S)
N$174: DRAINA37.P1(S) DRAINB37.P1(S) JD36.1 JD37.2 JP37.1 JS21.1 Q45.3(D)
N$175: GATEA37.P1(S) GATEB37.P1(S) Q45.1(G)
N$176: JP38.2 R46.1
N$177: JN38.2 JS38.2 Q46.2(S) SOURCEA38.P1(S) SOURCEB38.P1(S)
N$178: DRAINA38.P1(S) DRAINB38.P1(S) JD37.1 JD38.2 JP38.1 JS22.1 Q46.3(D)
N$179: GATEA38.P1(S) GATEB38.P1(S) Q46.1(G)
N$180: JP39.2 R47.1
N$181: JN39.2 JS39.2 Q47.2(S) SOURCEA39.P1(S) SOURCEB39.P1(S)
N$182: DRAINA39.P1(S) DRAINB39.P1(S) JD38.1 JD39.2 JP39.1 JS23.1 Q47.3(D)
N$183: GATEA39.P1(S) GATEB39.P1(S) Q47.1(G)
N$184: JP40.2 R48.1
N$185: JN40.2 JS40.2 Q48.2(S) SOURCEA40.P1(S) SOURCEB40.P1(S)
N$186: DRAINA40.P1(S) DRAINB40.P1(S) JD39.1 JD40.2 JP40.1 JS24.1 Q48.3(D)
N$187: GATEA40.P1(S) GATEB40.P1(S) Q48.1(G)
N$188: JP41.2 R49.1
N$189: JN41.2 JS41.2 Q49.2(S) SOURCEA41.P1(S) SOURCEB41.P1(S)
N$190: DRAINA41.P1(S) DRAINB41.P1(S) JD40.1 JD41.2 JP41.1 JS25.1 Q49.3(D)
N$191: GATEA41.P1(S) GATEB41.P1(S) Q49.1(G)
N$192: JP42.2 R50.1
N$193: JN42.2 JS42.2 Q50.2(S) SOURCEA42.P1(S) SOURCEB42.P1(S)
N$194: DRAINA42.P1(S) DRAINB42.P1(S) JD41.1 JD42.2 JP42.1 JS26.1 Q50.3(D)
N$195: GATEA42.P1(S) GATEB42.P1(S) Q50.1(G)
N$196: JP43.2 R51.1
N$197: JN43.2 JS43.2 Q51.2(S) SOURCEA43.P1(S) SOURCEB43.P1(S)
N$198: DRAINA43.P1(S) DRAINB43.P1(S) JD42.1 JD43.2 JP43.1 JS27.1 Q51.3(D)
N$199: GATEA43.P1(S) GATEB43.P1(S) Q51.1(G)
N$200: JP44.2 R52.1
N$201: JN44.2 JS44.2 Q52.2(S) SOURCEA44.P1(S) SOURCEB44.P1(S)
N$202: DRAINA44.P1(S) DRAINB44.P1(S) JD43.1 JD44.2 JP44.1 JS28.1 Q52.3(D)
N$203: GATEA44.P1(S) GATEB44.P1(S) Q52.1(G)
N$204: JP45.2 R53.1
N$205: JN45.2 JS45.2 Q53.2(S) SOURCEA45.P1(S) SOURCEB45.P1(S)
N$206: DRAINA45.P1(S) DRAINB45.P1(S) JD44.1 JD45.2 JP45.1 JS29.1 Q53.3(D)
N$207: GATEA45.P1(S) GATEB45.P1(S) Q53.1(G)
N$208: JP46.2 R54.1
N$209: JN46.2 JS46.2 Q54.2(S) SOURCEA46.P1(S) SOURCEB46.P1(S)
N$210: DRAINA46.P1(S) DRAINB46.P1(S) JD45.1 JD46.2 JP46.1 JS30.1 Q54.3(D)
N$211: GATEA46.P1(S) GATEB46.P1(S) Q54.1(G)
N$212: JP47.2 R55.1
N$213: JN47.2 JS47.2 Q55.2(S) SOURCEA47.P1(S) SOURCEB47.P1(S)
N$214: DRAINA47.P1(S) DRAINB47.P1(S) JD46.1 JD47.2 JP47.1 JS31.1 Q55.3(D)
N$215: GATEA47.P1(S) GATEB47.P1(S) Q55.1(G)
N$216: JP48.2 R56.1
N$217: JN48.2 JS48.2 Q56.2(S) SOURCEA48.P1(S) SOURCEB48.P1(S)
N$218: DRAINA48.P1(S) DRAINB48.P1(S) JD47.1 JD48.2 JP48.1 JS32.1 Q56.3(D)
N$219: GATEA48.P1(S) GATEB48.P1(S) Q56.1(G)
N$220: JP49.2 R57.1
N$221: JN49.2 JS49.2 Q57.2(S) SOURCEA49.P1(S) SOURCEB49.P1(S)
N$222: DRAINA49.P1(S) DRAINB49.P1(S) JD49.2 JP49.1 JS65.1 Q57.3(D)
N$223: GATEA49.P1(S) GATEB49.P1(S) Q57.1(G)
N$224: JP50.2 R58.1
N$225: JN50.2 JS50.2 Q58.2(S) SOURCEA50.P1(S) SOURCEB50.P1(S)
N$226: DRAINA50.P1(S) DRAINB50.P1(S) JD49.1 JD50.2 JP50.1 JS66.1 Q58.3(D)
N$227: GATEA50.P1(S) GATEB50.P1(S) Q58.1(G)
N$228: JP51.2 R59.1
N$229: JN51.2 JS51.2 Q59.2(S) SOURCEA51.P1(S) SOURCEB51.P1(S)
N$230: DRAINA51.P1(S) DRAINB51.P1(S) JD50.1 JD51.2 JP51.1 JS67.1 Q59.3(D)
N$231: GATEA51.P1(S) GATEB51.P1(S) Q59.1(G)
N$232: JP52.2 R60.1
N$233: JN52.2 JS52.2 Q60.2(S) SOURCEA52.P1(S) SOURCEB52.P1(S)
N$234: DRAINA52.P1(S) DRAINB52.P1(S) JD51.1 JD52.2 JP52.1 JS68.1 Q60.3(D)
N$235: GATEA52.P1(S) GATEB52.P1(S) Q60.1(G)
N$236: JP53.2 R61.1
N$237: JN53.2 JS53.2 Q61.2(S) SOURCEA53.P1(S) SOURCEB53.P1(S)
N$238: DRAINA53.P1(S) DRAINB53.P1(S) JD52.1 JD53.2 JP53.1 JS69.1 Q61.3(D)
N$239: GATEA53.P1(S) GATEB53.P1(S) Q61.1(G)
N$240: JP54.2 R62.1
N$241: JN54.2 JS54.2 Q62.2(S) SOURCEA54.P1(S) SOURCEB54.P1(S)
N$242: DRAINA54.P1(S) DRAINB54.P1(S) JD53.1 JD54.2 JP54.1 JS70.1 Q62.3(D)
N$243: GATEA54.P1(S) GATEB54.P1(S) Q62.1(G)
N$244: JP55.2 R63.1
N$245: JN55.2 JS55.2 Q63.2(S) SOURCEA55.P1(S) SOURCEB55.P1(S)
N$246: DRAINA55.P1(S) DRAINB55.P1(S) JD54.1 JD55.2 JP55.1 JS71.1 Q63.3(D)
N$247: GATEA55.P1(S) GATEB55.P1(S) Q63.1(G)
N$248: JP56.2 R64.1
N$249: JN56.2 JS56.2 Q64.2(S) SOURCEA56.P1(S) SOURCEB56.P1(S)
N$250: DRAINA56.P1(S) DRAINB56.P1(S) JD55.1 JD56.2 JP56.1 JS72.1 Q64.3(D)
N$251: GATEA56.P1(S) GATEB56.P1(S) Q64.1(G)
N$252: JP57.2 R65.1
N$253: JN57.2 JS57.2 Q65.2(S) SOURCEA57.P1(S) SOURCEB57.P1(S)
N$254: DRAINA57.P1(S) DRAINB57.P1(S) JD56.1 JD57.2 JP57.1 JS73.1 Q65.3(D)
N$255: GATEA57.P1(S) GATEB57.P1(S) Q65.1(G)
N$256: JP58.2 R66.1
N$257: JN58.2 JS58.2 Q66.2(S) SOURCEA58.P1(S) SOURCEB58.P1(S)
N$258: DRAINA58.P1(S) DRAINB58.P1(S) JD57.1 JD58.2 JP58.1 JS74.1 Q66.3(D)
N$259: GATEA58.P1(S) GATEB58.P1(S) Q66.1(G)
N$260: JP59.2 R67.1
N$261: JN59.2 JS59.2 Q67.2(S) SOURCEA59.P1(S) SOURCEB59.P1(S)
N$262: DRAINA59.P1(S) DRAINB59.P1(S) JD58.1 JD59.2 JP59.1 JS75.1 Q67.3(D)
N$263: GATEA59.P1(S) GATEB59.P1(S) Q67.1(G)
N$264: JP60.2 R68.1
N$265: JN60.2 JS60.2 Q68.2(S) SOURCEA60.P1(S) SOURCEB60.P1(S)
N$266: DRAINA60.P1(S) DRAINB60.P1(S) JD59.1 JD60.2 JP60.1 JS76.1 Q68.3(D)
N$267: GATEA60.P1(S) GATEB60.P1(S) Q68.1(G)
N$268: JP61.2 R69.1
N$269: JN61.2 JS61.2 Q69.2(S) SOURCEA61.P1(S) SOURCEB61.P1(S)
N$270: DRAINA61.P1(S) DRAINB61.P1(S) JD60.1 JD61.2 JP61.1 JS77.1 Q69.3(D)
N$271: GATEA61.P1(S) GATEB61.P1(S) Q69.1(G)
N$272: JP62.2 R70.1
N$273: JN62.2 JS62.2 Q70.2(S) SOURCEA62.P1(S) SOURCEB62.P1(S)
N$274: DRAINA62.P1(S) DRAINB62.P1(S) JD61.1 JD62.2 JP62.1 JS78.1 Q70.3(D)
N$275: GATEA62.P1(S) GATEB62.P1(S) Q70.1(G)
N$276: JP63.2 R71.1
N$277: JN63.2 JS63.2 Q71.2(S) SOURCEA63.P1(S) SOURCEB63.P1(S)
N$278: DRAINA63.P1(S) DRAINB63.P1(S) JD62.1 JD63.2 JP63.1 JS79.1 Q71.3(D)
N$279: GATEA63.P1(S) GATEB63.P1(S) Q71.1(G)
N$280: JP64.2 R72.1
N$281: JN64.2 JS64.2 Q72.2(S) SOURCEA64.P1(S) SOURCEB64.P1(S)
N$282: DRAINA64.P1(S) DRAINB64.P1(S) JD63.1 JD64.2 JP64.1 JS80.1 Q72.3(D)
N$283: GATEA64.P1(S) GATEB64.P1(S) Q72.1(G)
N$284: JP65.2 R73.1
N$285: JN65.2 JS65.2 Q73.2(S) SOURCEA65.P1(S) SOURCEB65.P1(S)
N$286: DRAINA65.P1(S) DRAINB65.P1(S) JD65.2 JP65.1 JS81.1 Q73.3(D)
N$287: GATEA65.P1(S) GATEB65.P1(S) Q73.1(G)
N$288: JP66.2 R74.1
N$289: JN66.2 JS66.2 Q74.2(S) SOURCEA66.P1(S) SOURCEB66.P1(S)
N$290: DRAINA66.P1(S) DRAINB66.P1(S) JD65.1 JD66.2 JP66.1 JS82.1 Q74.3(D)
N$291: GATEA66.P1(S) GATEB66.P1(S) Q74.1(G)
N$292: JP67.2 R79.1
N$293: JN67.2 JS67.2 Q75.2(S) SOURCEA67.P1(S) SOURCEB67.P1(S)
N$297: DRAINA67.P1(S) DRAINB67.P1(S) JD66.1 JD67.2 JP67.1 JS83.1 Q75.3(D)
N$301: GATEA67.P1(S) GATEB67.P1(S) Q75.1(G)
N$303: JP68.2 R80.1
N$304: JN68.2 JS68.2 Q76.2(S) SOURCEA68.P1(S) SOURCEB68.P1(S)
N$305: DRAINA68.P1(S) DRAINB68.P1(S) JD67.1 JD68.2 JP68.1 JS84.1 Q76.3(D)
N$307: GATEA68.P1(S) GATEB68.P1(S) Q76.1(G)